# EAGLE design 20A-20 (EAGLE 6.3)

## Sheet 1 of 11
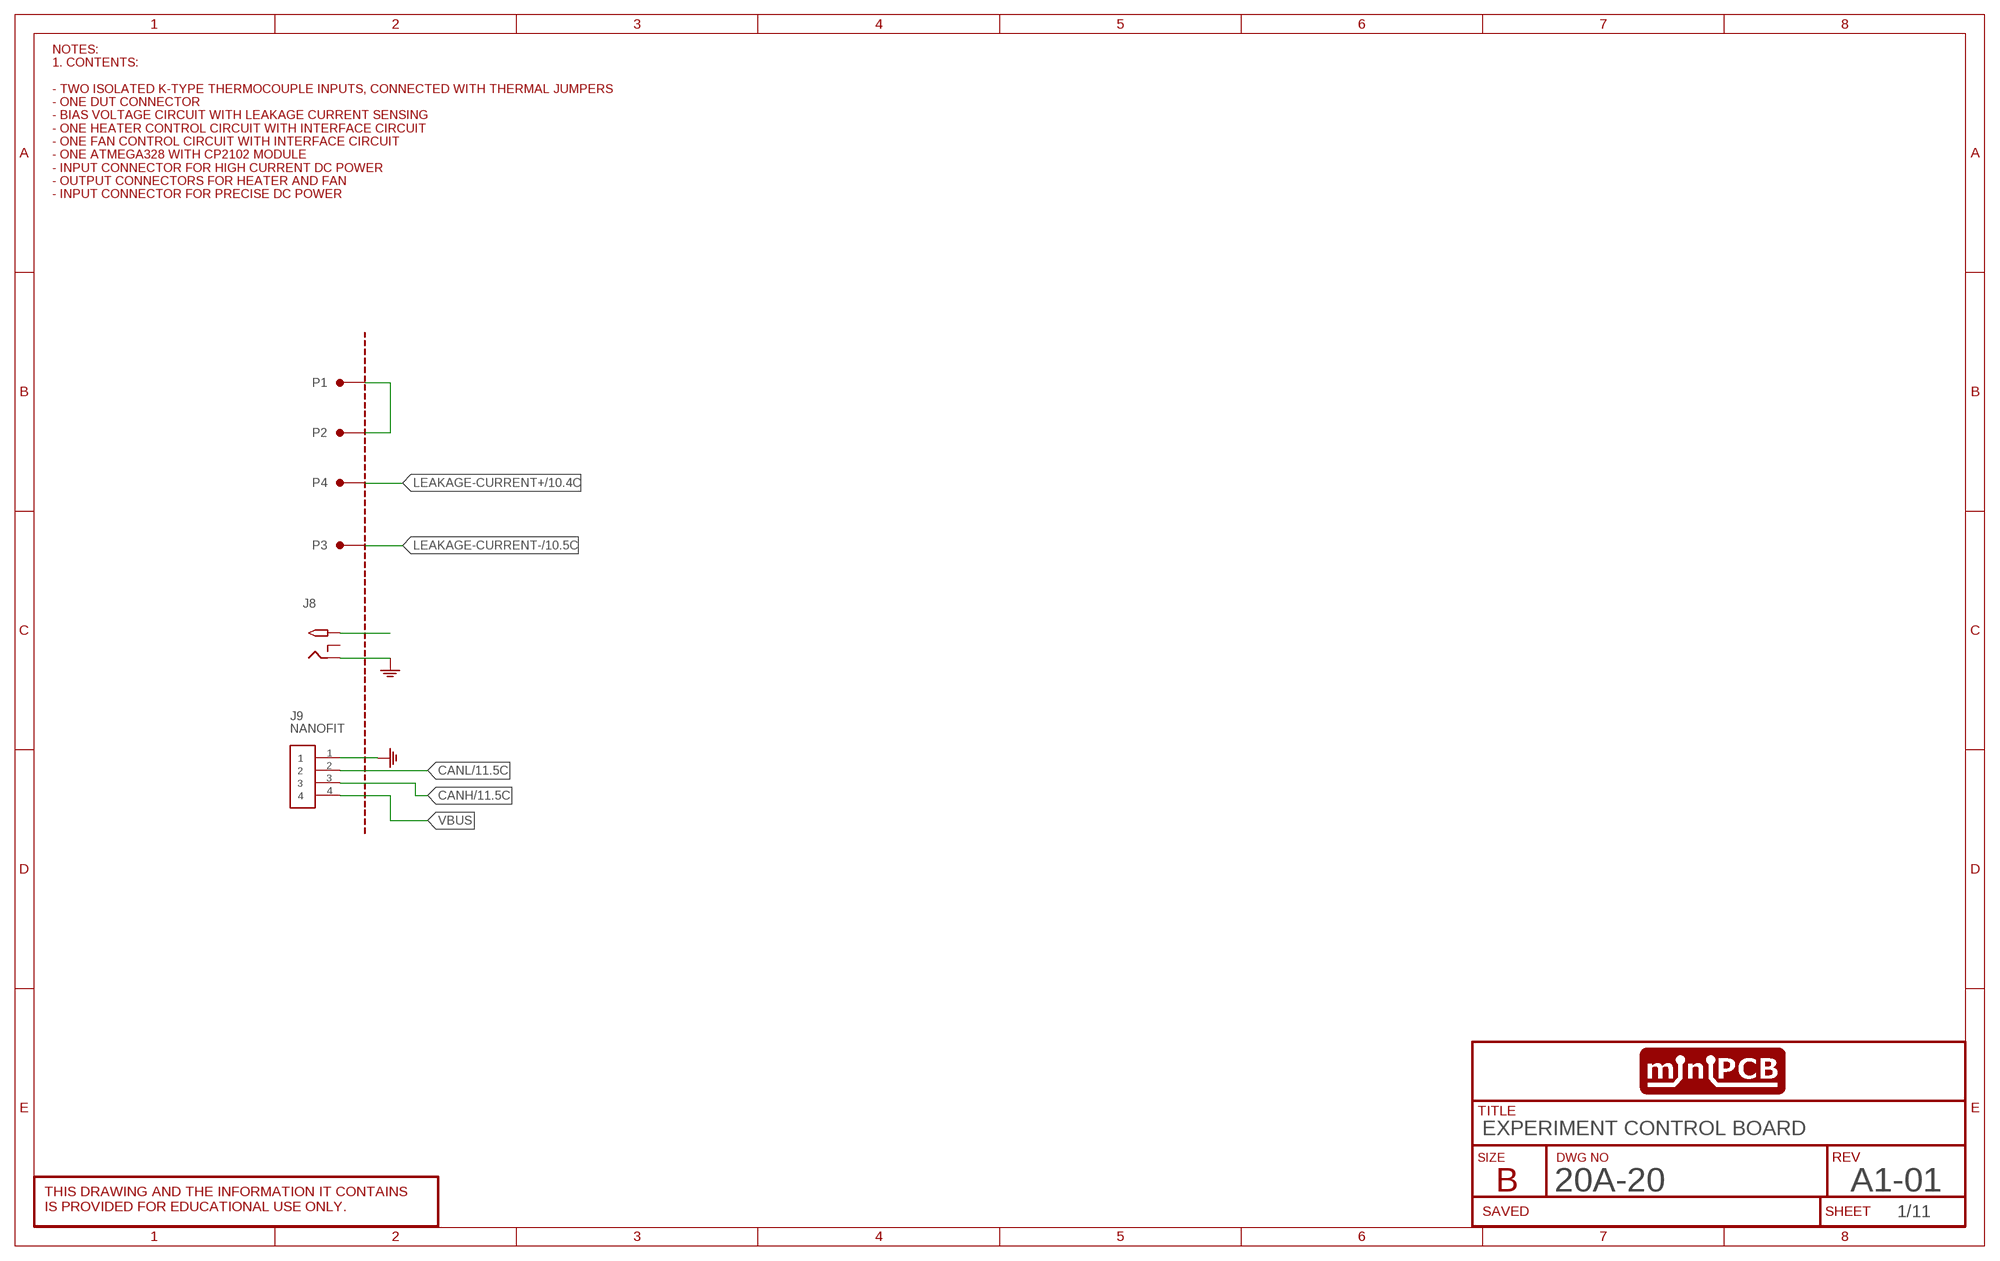
[diagram p0: schematic, sheet 1]
SHEET1 (SCHEMATIC): DWG_NO: 20A-20; REV: A1-01; TITLE: EXPERIMENT CONTROL BOARD

### Parts
J8  2.1MMJACKTHM  [PJ-102A]
J9  NANOFIT  PINS_4-NANOFIT  [PINS_4_NANOFIT_RA]
P1  PINS_1571-0500  [BANNAN_JACK_4MM_H]
P2  PINS_1571-0500  [BANNAN_JACK_4MM_H]
P3  PINS_1571-0500  [BANNAN_JACK_4MM_H]
P4  PINS_1571-0500  [BANNAN_JACK_4MM_H]
PCB1  MINIPCB_0P100X100  [MINIPCB_DOCK_100X100]

### Nets
CANH: J9.3 ; also sheet 11
CANL: J9.2 ; also sheet 11
GND: J8.RING J9.1 ; also sheet 2,3,4,5,6,7,8,10,11
LEAKAGE-CURRENT+: P4.1 P4.2 ; also sheet 10
LEAKAGE-CURRENT-: P3.1 P3.2 ; also sheet 10
N$50: J8.TIP
N$51: P1.1 P1.2 P2.1 P2.2
VBUS: J9.4
Unconnected: J8.RING_SW

### Notes on the sheet
- NOTES:
  1. CONTENTS:
  
  - TWO ISOLATED K-TYPE THERMOCOUPLE INPUTS, CONNECTED WITH THERMAL JUMPERS
  - ONE DUT CONNECTOR
  - BIAS VOLTAGE CIRCUIT WITH LEAKAGE CURRENT SENSING
  - ONE HEATER CONTROL CIRCUIT WITH INTERFACE CIRCUIT
  - ONE FAN CONTROL CIRCUIT WITH INTERFACE CIRCUIT
  - ONE ATMEGA328 WITH CP2102 MODULE
  - INPUT CONNECTOR FOR HIGH CURRENT DC POWER
  - OUTPUT CONNECTORS FOR HEATER AND FAN
  - INPUT CONNECTOR FOR PRECISE DC POWER

## Sheet 2 of 11
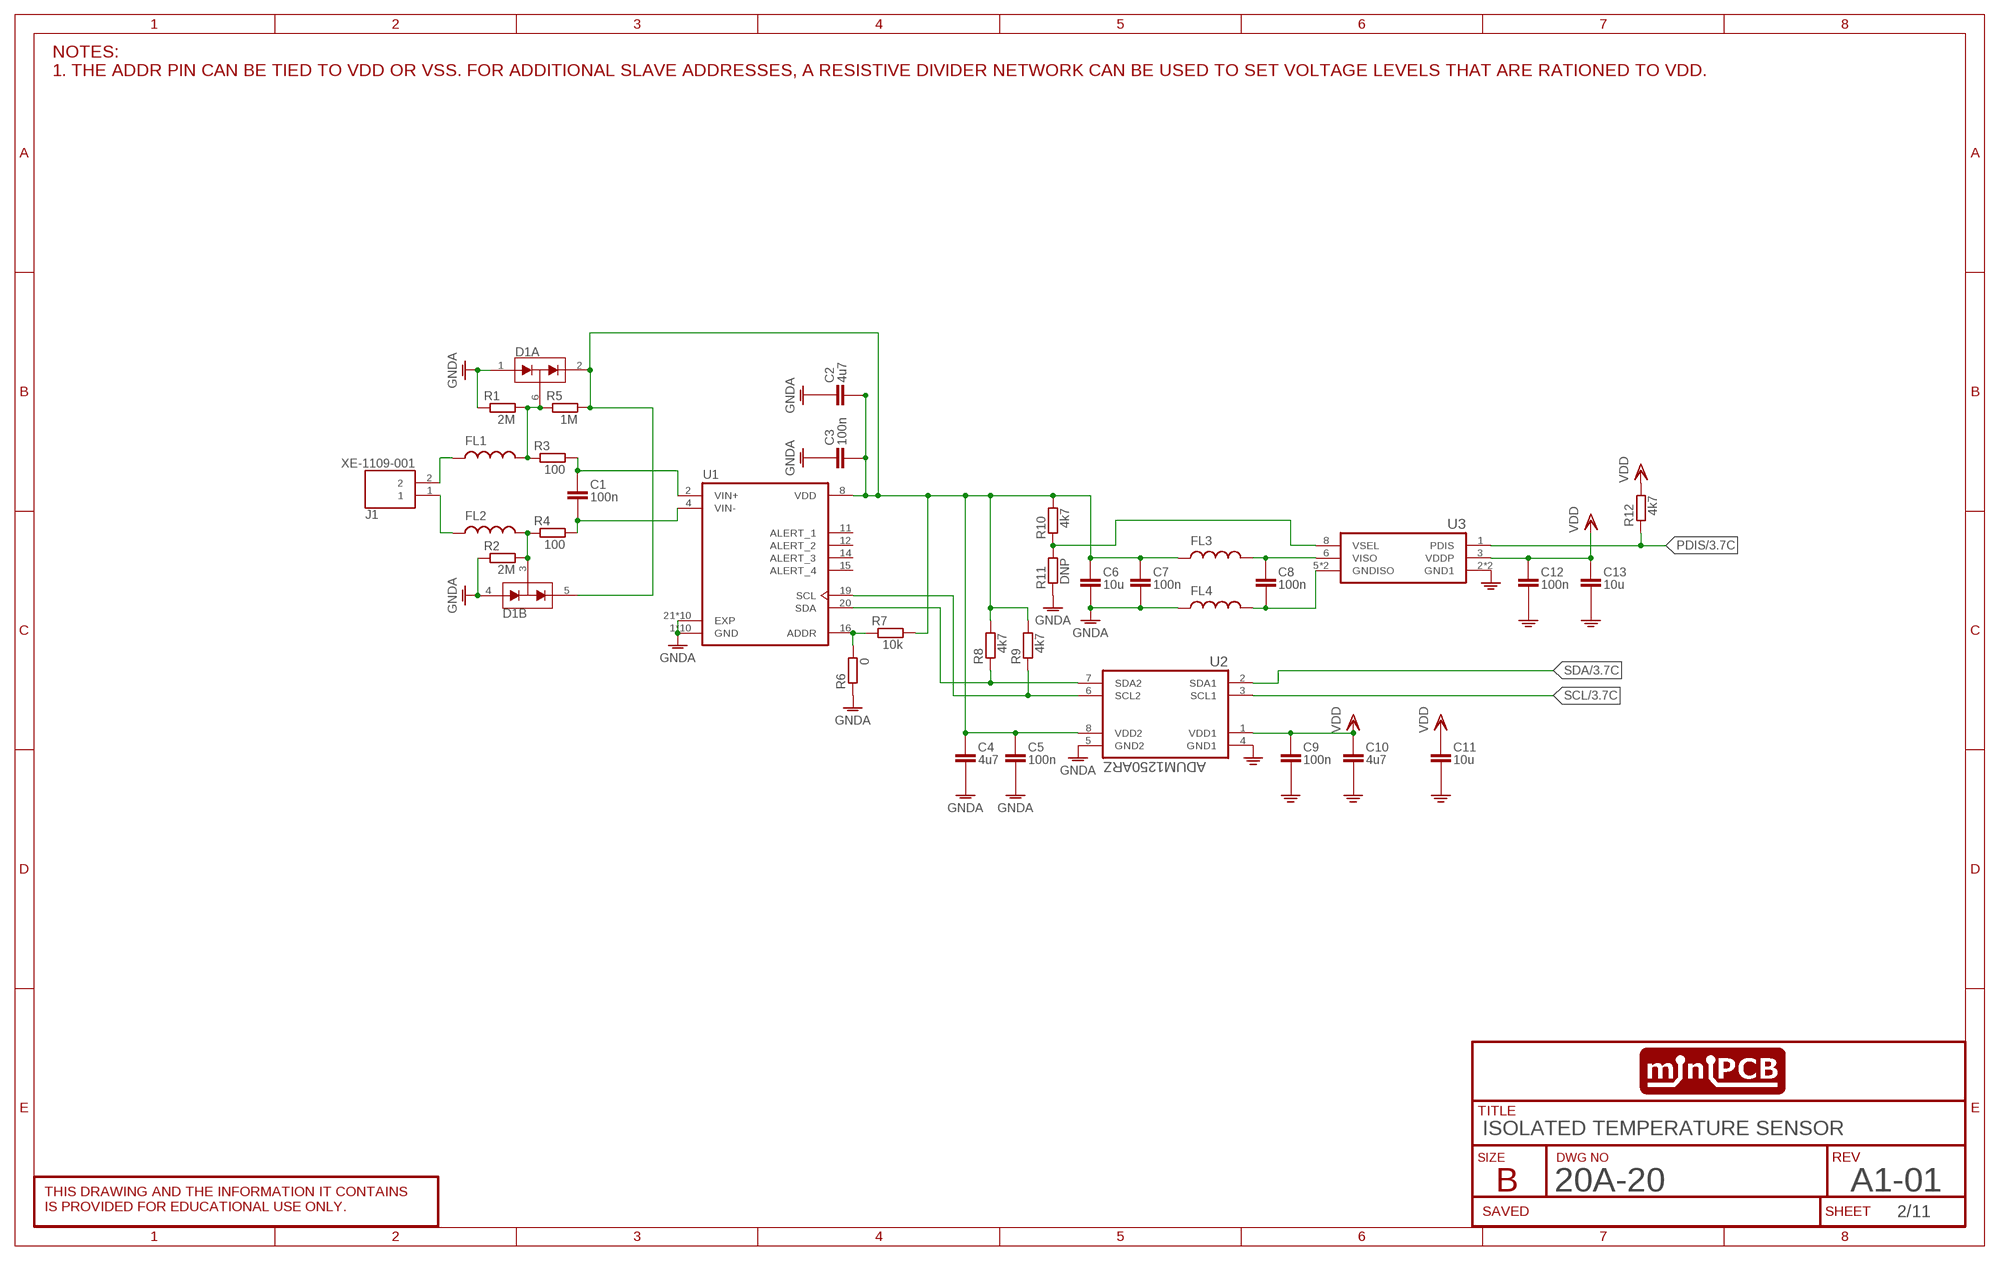
[diagram p1: schematic, sheet 2]
SHEET2 (SCHEMATIC): DWG_NO: 16A-01; REV: A1-01; TITLE: ISOLATED TEMPERATURE SENSOR

### Parts
C1  100n  CAPACITOR0402  [C0402]
C2  4u7  CAPACITOR0402  [C0402]
C3  100n  CAPACITOR0402  [C0402]
C4  4u7  CAPACITOR0402  [C0402]
C5  100n  CAPACITOR0402  [C0402]
C6  10u  CAPACITORSMD  [C0805]
C7  100n  CAPACITOR0402  [C0402]
C8  100n  CAPACITOR0402  [C0402]
C9  100n  CAPACITOR0402  [C0402]
C10  4u7  CAPACITOR0402  [C0402]
C11  10u  CAPACITORSMD  [C0805]
C12  100n  CAPACITOR0402  [C0402]
C13  10u  CAPACITORSMD  [C0805]
D1  SDA004-7  [SOT363]
FL1  BLM03HG601SZ1D  [R0402]
FL2  BLM03HG601SZ1D  [R0402]
FL3  BLM03HG601SZ1D  [R0402]
FL4  BLM03HG601SZ1D  [R0402]
J1  XE-1109-001  [XE-1109-001]
R1  2M  RESISTOR0402  [R0402]
R2  2M  RESISTOR0402  [R0402]
R3  100  RESISTOR0402  [R0402]
R4  100  RESISTOR0402  [R0402]
R5  1M  RESISTOR0402  [R0402]
R6  0  RESISTOR0402  [R0402]
R7  10k  RESISTOR0402  [R0402]
R8  4k7  RESISTOR0402  [R0402]
R9  4k7  RESISTOR0402  [R0402]
R10  4k7  RESISTOR0402  [R0402]
R11  DNP  RESISTOR0402  [R0402]
R12  4k7  RESISTOR0402  [R0402]
U1  MCP9600T-I/MX  [QFN65P500X500X100-21N_MCP9600T-I/MX]
U2  ADUM1250ARZ  [SOIC127P600X175-8N]
U3  ADUM6280  [SOIC127P600X175-8N]

### Nets
GND: C9.2(-) C10.2(-) C11.2ASDF(-) C12.2(-) C13.2ASDF(-) U2.4(GND1) U3.2(GND1) U3.4(GND1) ; also sheet 1,3,4,5,6,7,8,10,11
GNDA: C2.1(+) C3.1(+) C4.2(-) C5.2(-) C6.2ASDF(-) C7.2(-) D1.1(A:A1) D1.4(B:A1) FL4.1 R1.1 R2.1 R6.1 R11.1 U1.1(GND) U1.3(GND) U1.5(GND) U1.6(GND) U1.7(GND) U1.9(GND) U1.10(GND) U1.13(GND) U1.17(GND) U1.18(GND) U1.21(EXP) U1.22(EXP) U1.23(EXP) U1.24(EXP) U1.25(EXP) U1.26(EXP) U1.27(EXP) U1.28(EXP) U1.29(EXP) U1.30(EXP) U2.5(GND2) ; also sheet 3
N$1: D1.6(A:COM) FL1.2 R1.2 R3.1 R5.1
N$2: R9.1 U1.19(SCL) U2.6(SCL2)
N$3: R8.1 U1.20(SDA) U2.7(SDA2)
N$5: C8.2(-) FL4.2 U3.5(GNDISO) U3.7(GNDISO)
N$6: C8.1(+) FL3.2 U3.6(VISO)
N$7: R10.1 R11.2 U3.8(VSEL)
N$9: R6.2 R7.1 U1.16(ADDR)
N$10: C1.1(+) R3.2 U1.2(VIN+)
N$11: D1.3(B:COM) FL2.2 R2.2 R4.1
N$12: C1.2(-) R4.2 U1.4(VIN-)
N$13: FL1.1 J1.2
N$14: FL2.1 J1.1
PDIS: R12.1 U3.1(PDIS) ; also sheet 3,8
SCL: U2.3(SCL1) ; also sheet 3,4,8,10
SDA: U2.2(SDA1) ; also sheet 3,4,8,10
VDD: C9.1(+) C10.1(+) C11.1ASD(+) C12.1(+) C13.1ASD(+) R12.2 U2.1(VDD1) U3.3(VDDP) ; also sheet 3,4,5,6,7,8,10,11
VISO: C2.2(-) C3.2(-) C4.1(+) C5.1(+) C6.1ASD(+) C7.1(+) D1.2(A:C2) D1.5(B:C2) FL3.1 R5.2 R7.2 R8.2 R9.2 R10.2 U1.8(VDD) U2.8(VDD2)
Unconnected: U1.11(ALERT_1) U1.12(ALERT_2) U1.14(ALERT_3) U1.15(ALERT_4)

### Notes on the sheet
- NOTES:
  1. THE ADDR PIN CAN BE TIED TO VDD OR VSS. FOR ADDITIONAL SLAVE ADDRESSES, A RESISTIVE DIVIDER NETWORK CAN BE USED TO SET VOLTAGE LEVELS THAT ARE RATIONED TO VDD.

## Sheet 3 of 11
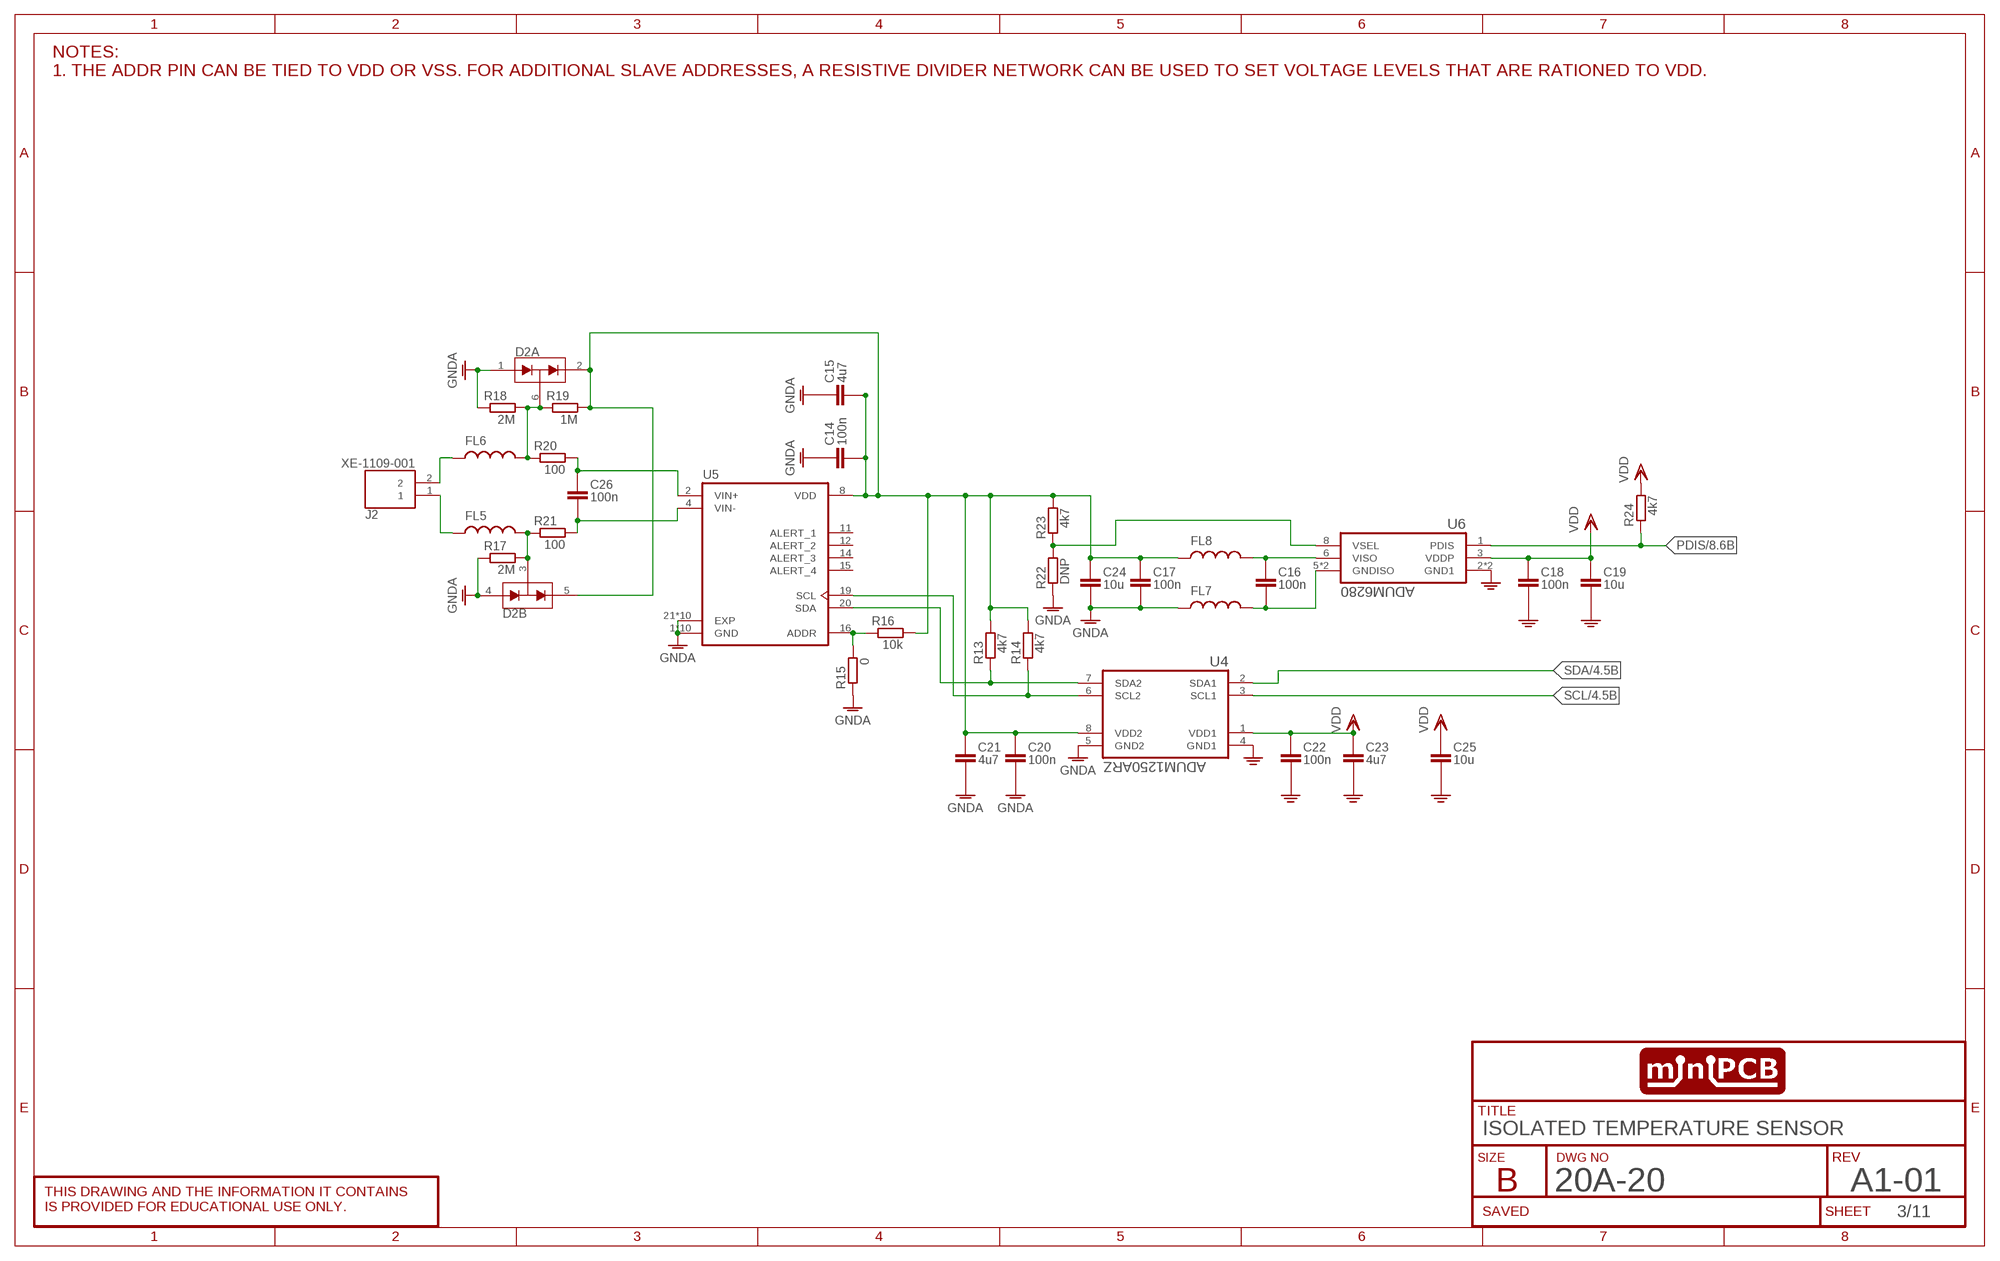
[diagram p2: schematic, sheet 3]
SHEET3 (SCHEMATIC): DWG_NO: 16A-01; REV: A1-01; TITLE: ISOLATED TEMPERATURE SENSOR

### Parts
C14  100n  CAPACITOR0402  [C0402]
C15  4u7  CAPACITOR0402  [C0402]
C16  100n  CAPACITOR0402  [C0402]
C17  100n  CAPACITOR0402  [C0402]
C18  100n  CAPACITOR0402  [C0402]
C19  10u  CAPACITORSMD  [C0805]
C20  100n  CAPACITOR0402  [C0402]
C21  4u7  CAPACITOR0402  [C0402]
C22  100n  CAPACITOR0402  [C0402]
C23  4u7  CAPACITOR0402  [C0402]
C24  10u  CAPACITORSMD  [C0805]
C25  10u  CAPACITORSMD  [C0805]
C26  100n  CAPACITOR0402  [C0402]
D2  SDA004-7  [SOT363]
FL5  BLM03HG601SZ1D  [R0402]
FL6  BLM03HG601SZ1D  [R0402]
FL7  BLM03HG601SZ1D  [R0402]
FL8  BLM03HG601SZ1D  [R0402]
J2  XE-1109-001  [XE-1109-001]
R13  4k7  RESISTOR0402  [R0402]
R14  4k7  RESISTOR0402  [R0402]
R15  0  RESISTOR0402  [R0402]
R16  10k  RESISTOR0402  [R0402]
R17  2M  RESISTOR0402  [R0402]
R18  2M  RESISTOR0402  [R0402]
R19  1M  RESISTOR0402  [R0402]
R20  100  RESISTOR0402  [R0402]
R21  100  RESISTOR0402  [R0402]
R22  DNP  RESISTOR0402  [R0402]
R23  4k7  RESISTOR0402  [R0402]
R24  4k7  RESISTOR0402  [R0402]
U4  ADUM1250ARZ  [SOIC127P600X175-8N]
U5  MCP9600T-I/MX  [QFN65P500X500X100-21N_MCP9600T-I/MX]
U6  ADUM6280  [SOIC127P600X175-8N]

### Nets
GND: C18.2(-) C19.2ASDF(-) C22.2(-) C23.2(-) C25.2ASDF(-) U4.4(GND1) U6.2(GND1) U6.4(GND1) ; also sheet 1,2,4,5,6,7,8,10,11
GNDA: C14.1(+) C15.1(+) C17.2(-) C20.2(-) C21.2(-) C24.2ASDF(-) D2.1(A:A1) D2.4(B:A1) FL7.1 R15.1 R17.1 R18.1 R22.1 U4.5(GND2) U5.1(GND) U5.3(GND) U5.5(GND) U5.6(GND) U5.7(GND) U5.9(GND) U5.10(GND) U5.13(GND) U5.17(GND) U5.18(GND) U5.21(EXP) U5.22(EXP) U5.23(EXP) U5.24(EXP) U5.25(EXP) U5.26(EXP) U5.27(EXP) U5.28(EXP) U5.29(EXP) U5.30(EXP) ; also sheet 2
N$4: R14.1 U4.6(SCL2) U5.19(SCL)
N$8: R13.1 U4.7(SDA2) U5.20(SDA)
N$15: R15.2 R16.1 U5.16(ADDR)
N$16: D2.6(A:COM) FL6.2 R18.2 R19.1 R20.1
N$17: D2.3(B:COM) FL5.2 R17.2 R21.1
N$18: C26.1(+) R20.2 U5.2(VIN+)
N$19: C26.2(-) R21.2 U5.4(VIN-)
N$20: FL6.1 J2.2
N$21: FL5.1 J2.1
N$22: R22.2 R23.1 U6.8(VSEL)
N$23: C16.2(-) FL7.2 U6.5(GNDISO) U6.7(GNDISO)
N$24: C16.1(+) FL8.2 U6.6(VISO)
PDIS: R24.1 U6.1(PDIS) ; also sheet 2,8
SCL: U4.3(SCL1) ; also sheet 2,4,8,10
SDA: U4.2(SDA1) ; also sheet 2,4,8,10
VDD: C18.1(+) C19.1ASD(+) C22.1(+) C23.1(+) C25.1ASD(+) R24.2 U4.1(VDD1) U6.3(VDDP) ; also sheet 2,4,5,6,7,8,10,11
VISO1: C14.2(-) C15.2(-) C17.1(+) C20.1(+) C21.1(+) C24.1ASD(+) D2.2(A:C2) D2.5(B:C2) FL8.1 R13.2 R14.2 R16.2 R19.2 R23.2 U4.8(VDD2) U5.8(VDD)
Unconnected: U5.11(ALERT_1) U5.12(ALERT_2) U5.14(ALERT_3) U5.15(ALERT_4)

### Notes on the sheet
- NOTES:
  1. THE ADDR PIN CAN BE TIED TO VDD OR VSS. FOR ADDITIONAL SLAVE ADDRESSES, A RESISTIVE DIVIDER NETWORK CAN BE USED TO SET VOLTAGE LEVELS THAT ARE RATIONED TO VDD.

## Sheet 4 of 11
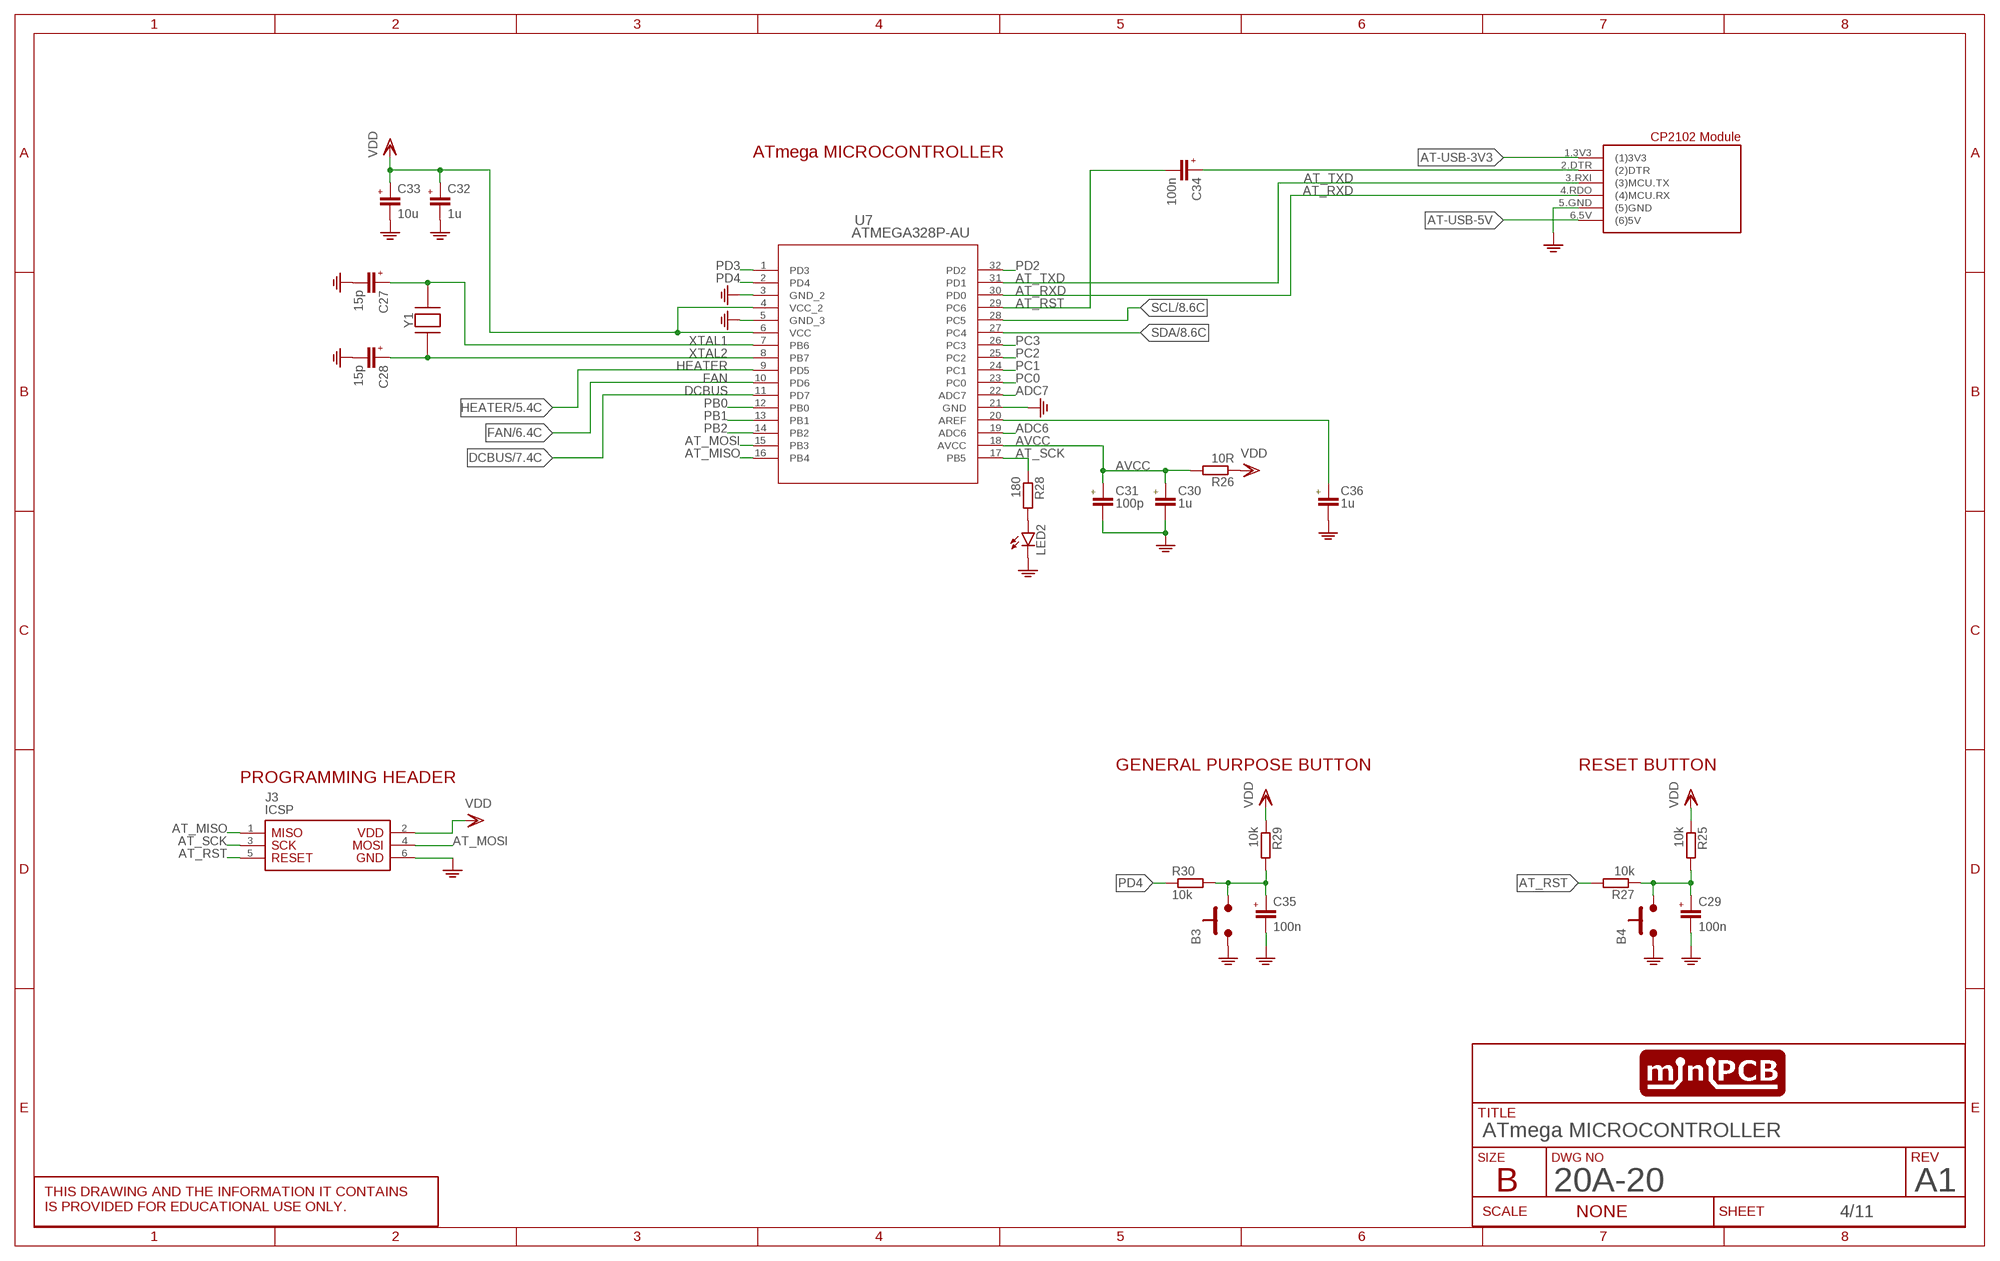
[diagram p3: schematic, sheet 4]
SHEET4 (SCHEMATIC): CIRCUIT_CATEGORY: COMPUTING; CIRCUIT_NAME: MICROCONTROLLER BOARD; CIRCUIT_VARIANT: PIC16F1829, ATmega328P-AU; DR: N. MANTEUFEL; DR_DATE: 31JUL2023; ENG: P. MORTON; ENG_DATE: 31JUL2023; PCB_PCBA: PRINTED CIRCUIT BOARD; REVA: A; REVISION: A1; TITLE: ATmega MICROCONTROLLER

### Parts
B3  PUSHBUTTON6X6MM  [6X6MM]
B4  PUSHBUTTON6X6MM  [6X6MM]
C27  15p  C0603  [C0603]
C28  15p  C0603  [C0603]
C29  100n  C0805  [C0805]
C30  1u  C-EU_C0805  [C0805]
C31  100p  C-EU_C0805  [C0805]
C32  1u  C0805  [C0805]
C33  10u  C0805  [C0805]
C34  100n  C0805  [C0805]
C35  100n  C0805  [C0805]
C36  1u  C-EU_C0805  [C0805]
J3  ICSP  PINS_6-2X3_AT  [PINS_6-2X3_AT]
LED2  LEDSML0805  [SML0805]
R25  10k  R-EU__R0805  [R0805]
R26  10R  R-EU__R0805  [R0805]
R27  10k  R-EU__R0805  [R0805]
R28  180  R-EU__R0805  [R0805]
R29  10k  R-EU__R0805  [R0805]
R30  10k  R-EU__R0805  [R0805]
U7  ATMEGA328P-AU  ATMEGA328-AU  [32A_ATM]
U8  VIVA_USB-TTL  [VIVA_USB_TTL_SUBTEXT]
Y1  CRYSTAL-3225_4P  [TXC7M2]

### Nets
ADC6: U7.19(ADC6)
ADC7: U7.22(ADC7)
AT-USB-3V3: U8.1.3V3((1)3V3)
AT-USB-5V: U8.6.5V((6)5V)
AT_DTR_CAP: C34.1(+) U8.2.DTR((2)DTR)
AT_MISO: J3.1 U7.16(PB4)
AT_MOSI: J3.4 U7.15(PB3)
AT_RST: C34.2(-) J3.5 R27.2 U7.29(PC6)
AT_RST_CAP: B4.3.B B4.4.B C29.1(+) R25.2 R27.1
AT_RXD: U7.30(PD0) U8.4.RDO((4)MCU.RX)
AT_SCK: J3.3 R28.1 U7.17(PB5)
AT_TXD: U7.31(PD1) U8.3.RXI((3)MCU.TX)
AVCC: C30.1 C31.1 R26.2 U7.18(AVCC)
DCBUS: U7.11(PD7) ; also sheet 7
FAN: U7.10(PD6) ; also sheet 6
GND: B3.1.A B3.2.A B4.1.A B4.2.A C27.1(-) C28.1(-) C29.2(-) C30.2 C31.2 C32.2(-) C33.2(-) C35.2(-) C36.2 J3.6 LED2.C U7.3(GND_2) U7.5(GND_3) U7.21(GND) U8.5.GND((5)GND) ; also sheet 1,2,3,5,6,7,8,10,11
HEATER: U7.9(PD5) ; also sheet 5
N$25: C36.1 U7.20(AREF)
N$37: LED2.A R28.2
PB0: U7.12(PB0)
PB1: U7.13(PB1)
PB2: U7.14(PB2)
PC0: U7.23(PC0)
PC1: U7.24(PC1)
PC2: U7.25(PC2)
PC3: U7.26(PC3)
PD2: U7.32(PD2)
PD3: U7.1(PD3)
PD4: R30.1 U7.2(PD4)
PD4-CAP: B3.3.B B3.4.B C35.1(+) R29.2 R30.2
SCL: U7.28(PC5) ; also sheet 2,3,8,10
SDA: U7.27(PC4) ; also sheet 2,3,8,10
VDD: C32.1(+) C33.1(+) J3.2 R25.1 R26.1 R29.1 U7.4(VCC_2) U7.6(VCC) ; also sheet 2,3,5,6,7,8,10,11
XTAL1: C27.2(+) U7.7(PB6) Y1.3
XTAL2: C28.2(+) U7.8(PB7) Y1.1

### Notes on the sheet
- ATmega MICROCONTROLLER
- GENERAL PURPOSE BUTTON | RESET BUTTON
- PROGRAMMING HEADER

## Sheet 5 of 11
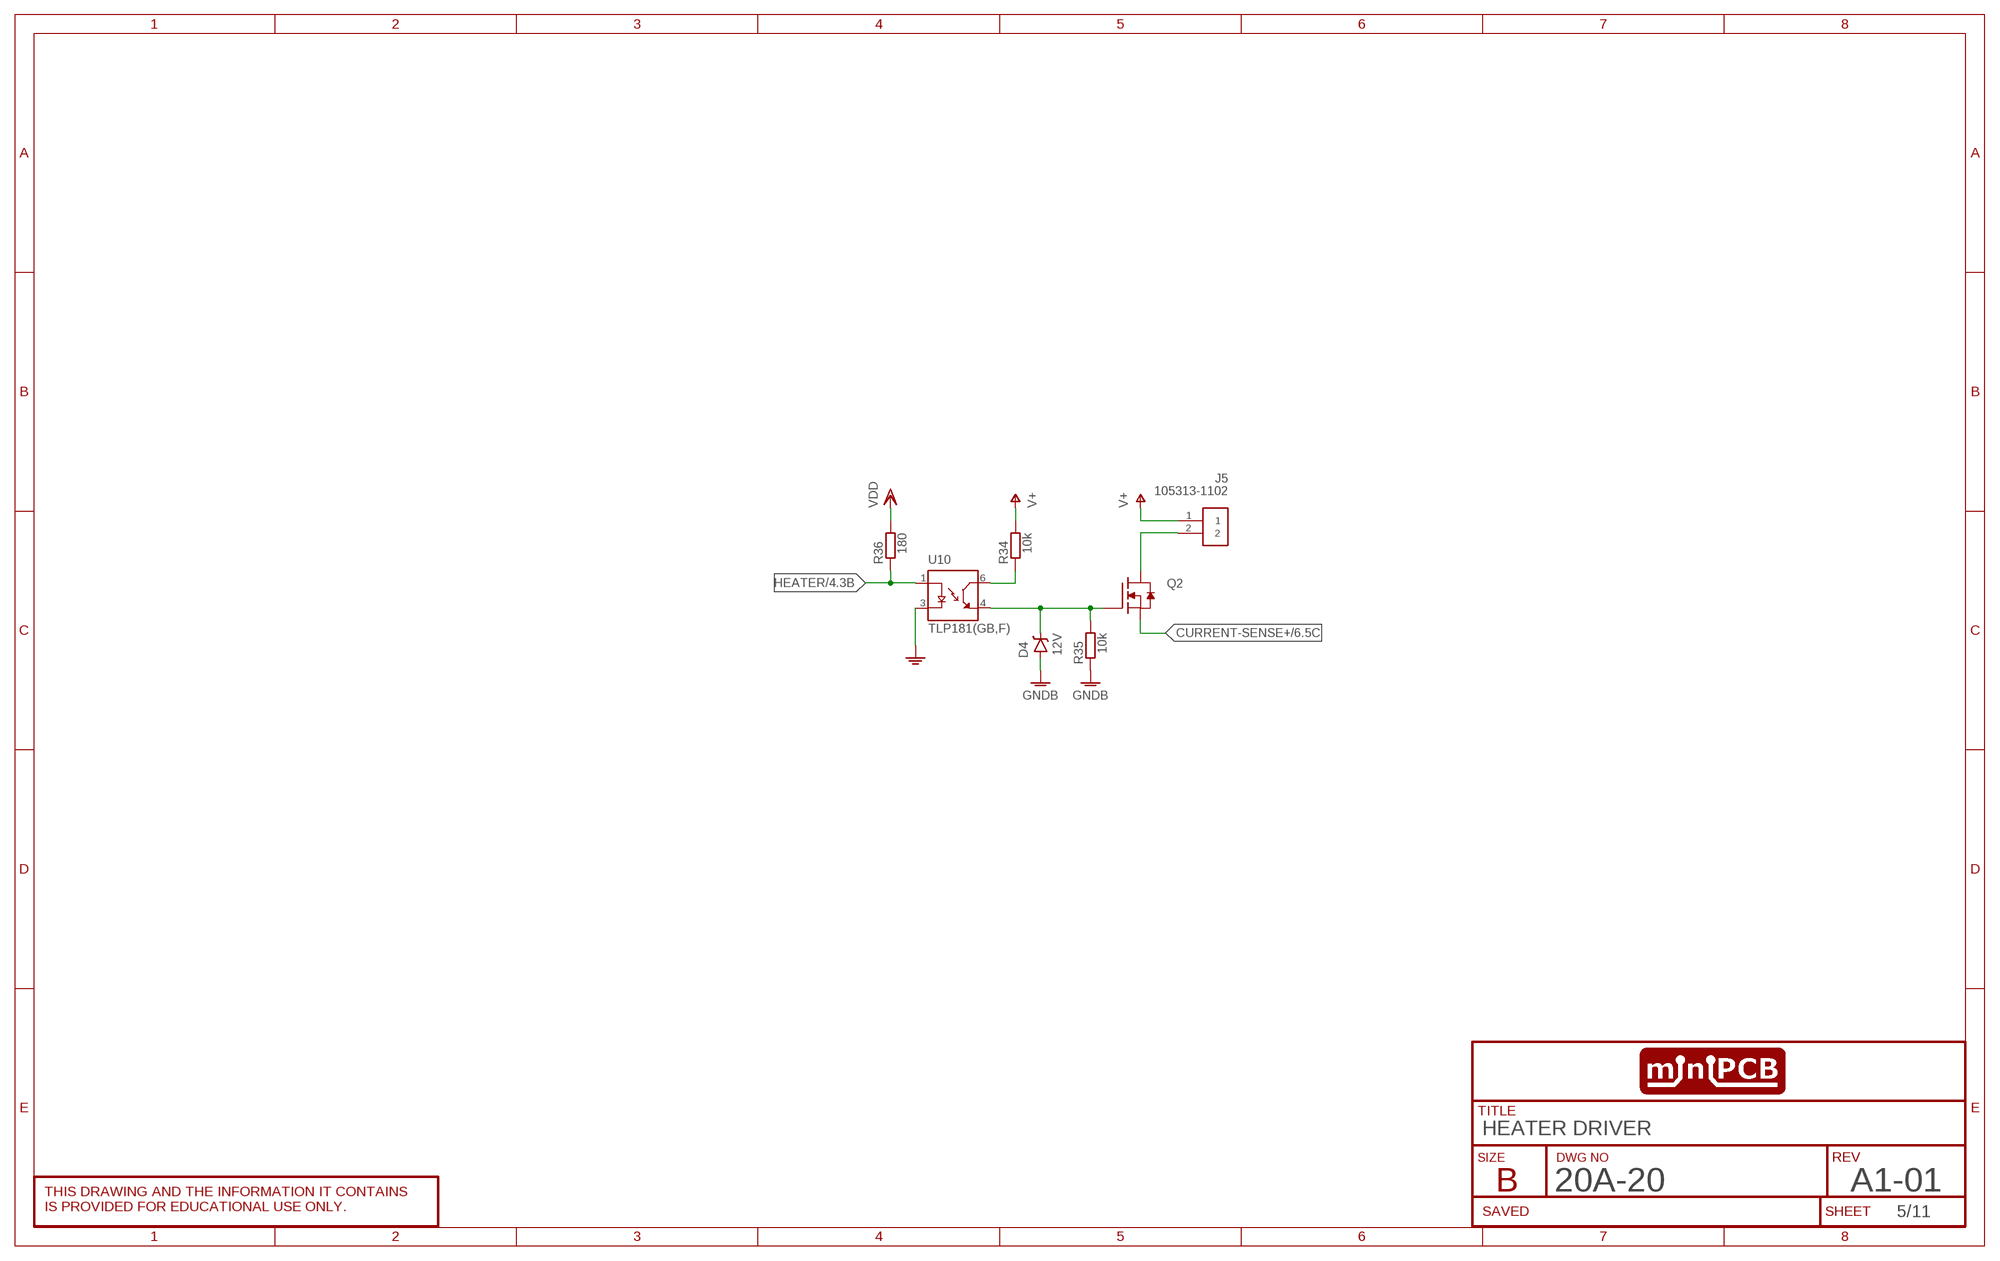
[diagram p4: schematic, sheet 5]
SHEET5 (SCHEMATIC): DWG_NO: 09F-01; REV: A1-01; TITLE: HEATER DRIVER

### Parts
D4  12V  ZENERSOT23  [SOT23]
J5  105313-1102  PINS_2-NANOFIT-105313-1102  [PINS_2-NANOFIT-H]
Q2  MOSFET-NDPAK  [DPACK]
R34  10k  RESISTORSMD  [R0805]
R35  10k  RESISTORSMD  [R0805]
R36  180  RESISTORSMD  [R0805]
U10  TLP181(GB,F)  [SOIC254P700X280-4N]

### Nets
CURRENT-SENSE+: Q2.3(S) ; also sheet 6,9
GND: U10.3(C) ; also sheet 1,2,3,4,6,7,8,10,11
GNDB: D4.1(A) R35.1 ; also sheet 6,7,8,9
HEATER: R36.1 U10.1(A) ; also sheet 4
N$28: D4.3(C) Q2.1(G) R35.2 U10.4(ET)
N$32: J5.2 Q2.4(D)
N$35: R34.1 U10.6(CT)
V+: J5.1 R34.2 ; also sheet 6,7
VDD: R36.2 ; also sheet 2,3,4,6,7,8,10,11

## Sheet 6 of 11
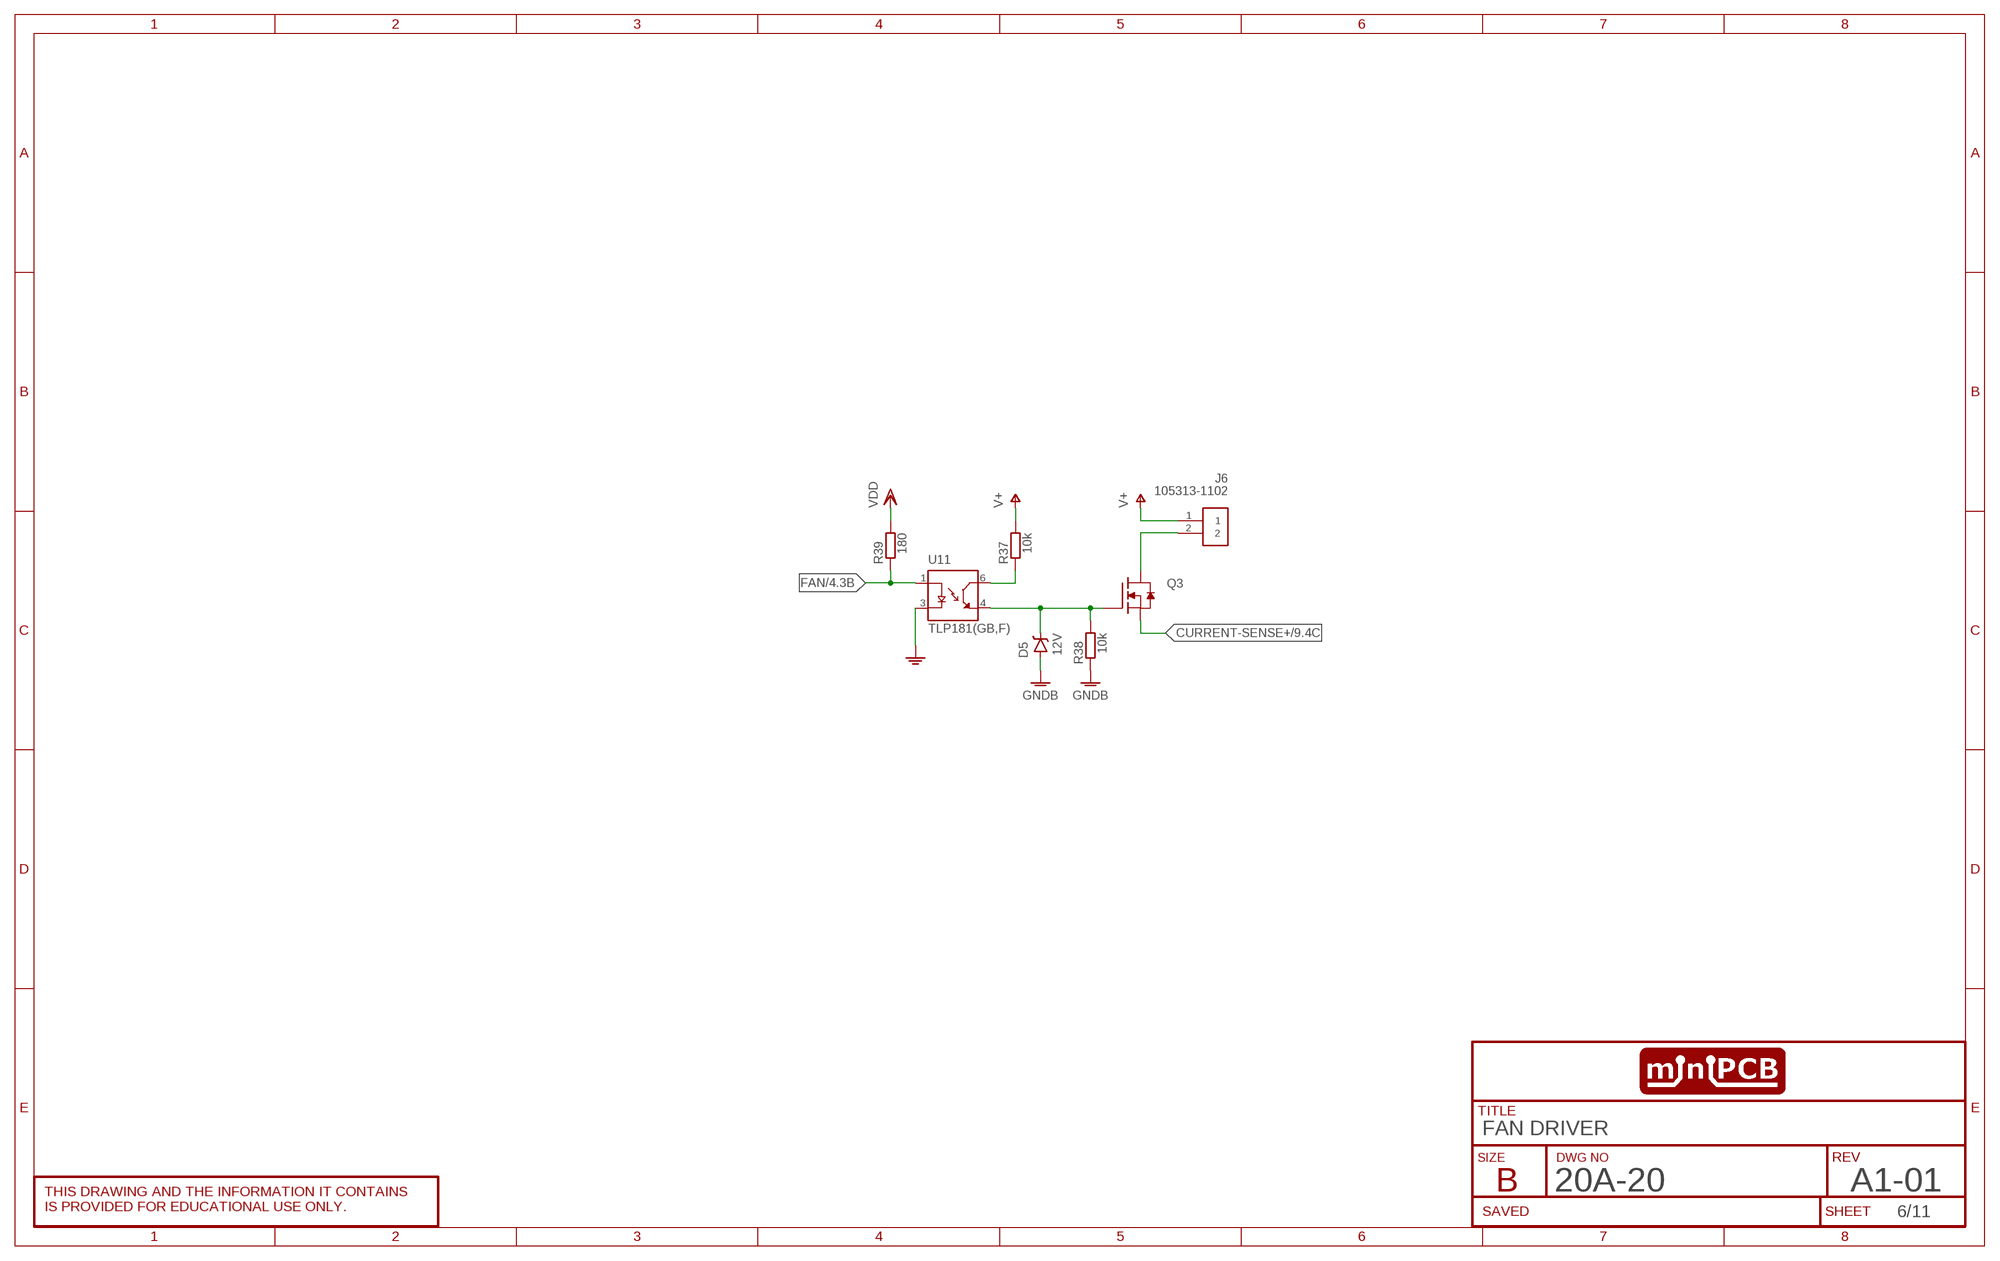
[diagram p5: schematic, sheet 6]
SHEET6 (SCHEMATIC): DWG_NO: 09F-01; REV: A1-01; TITLE: FAN DRIVER

### Parts
D5  12V  ZENERSOT23  [SOT23]
J6  105313-1102  PINS_2-NANOFIT-105313-1102  [PINS_2-NANOFIT-H]
Q3  MOSFET-NDPAK  [DPACK]
R37  10k  RESISTORSMD  [R0805]
R38  10k  RESISTORSMD  [R0805]
R39  180  RESISTORSMD  [R0805]
U11  TLP181(GB,F)  [SOIC254P700X280-4N]

### Nets
CURRENT-SENSE+: Q3.3(S) ; also sheet 5,9
FAN: R39.1 U11.1(A) ; also sheet 4
GND: U11.3(C) ; also sheet 1,2,3,4,5,7,8,10,11
GNDB: D5.1(A) R38.1 ; also sheet 5,7,8,9
N$33: D5.3(C) Q3.1(G) R38.2 U11.4(ET)
N$34: J6.2 Q3.4(D)
N$39: R37.1 U11.6(CT)
V+: J6.1 R37.2 ; also sheet 5,7
VDD: R39.2 ; also sheet 2,3,4,5,7,8,10,11

## Sheet 7 of 11
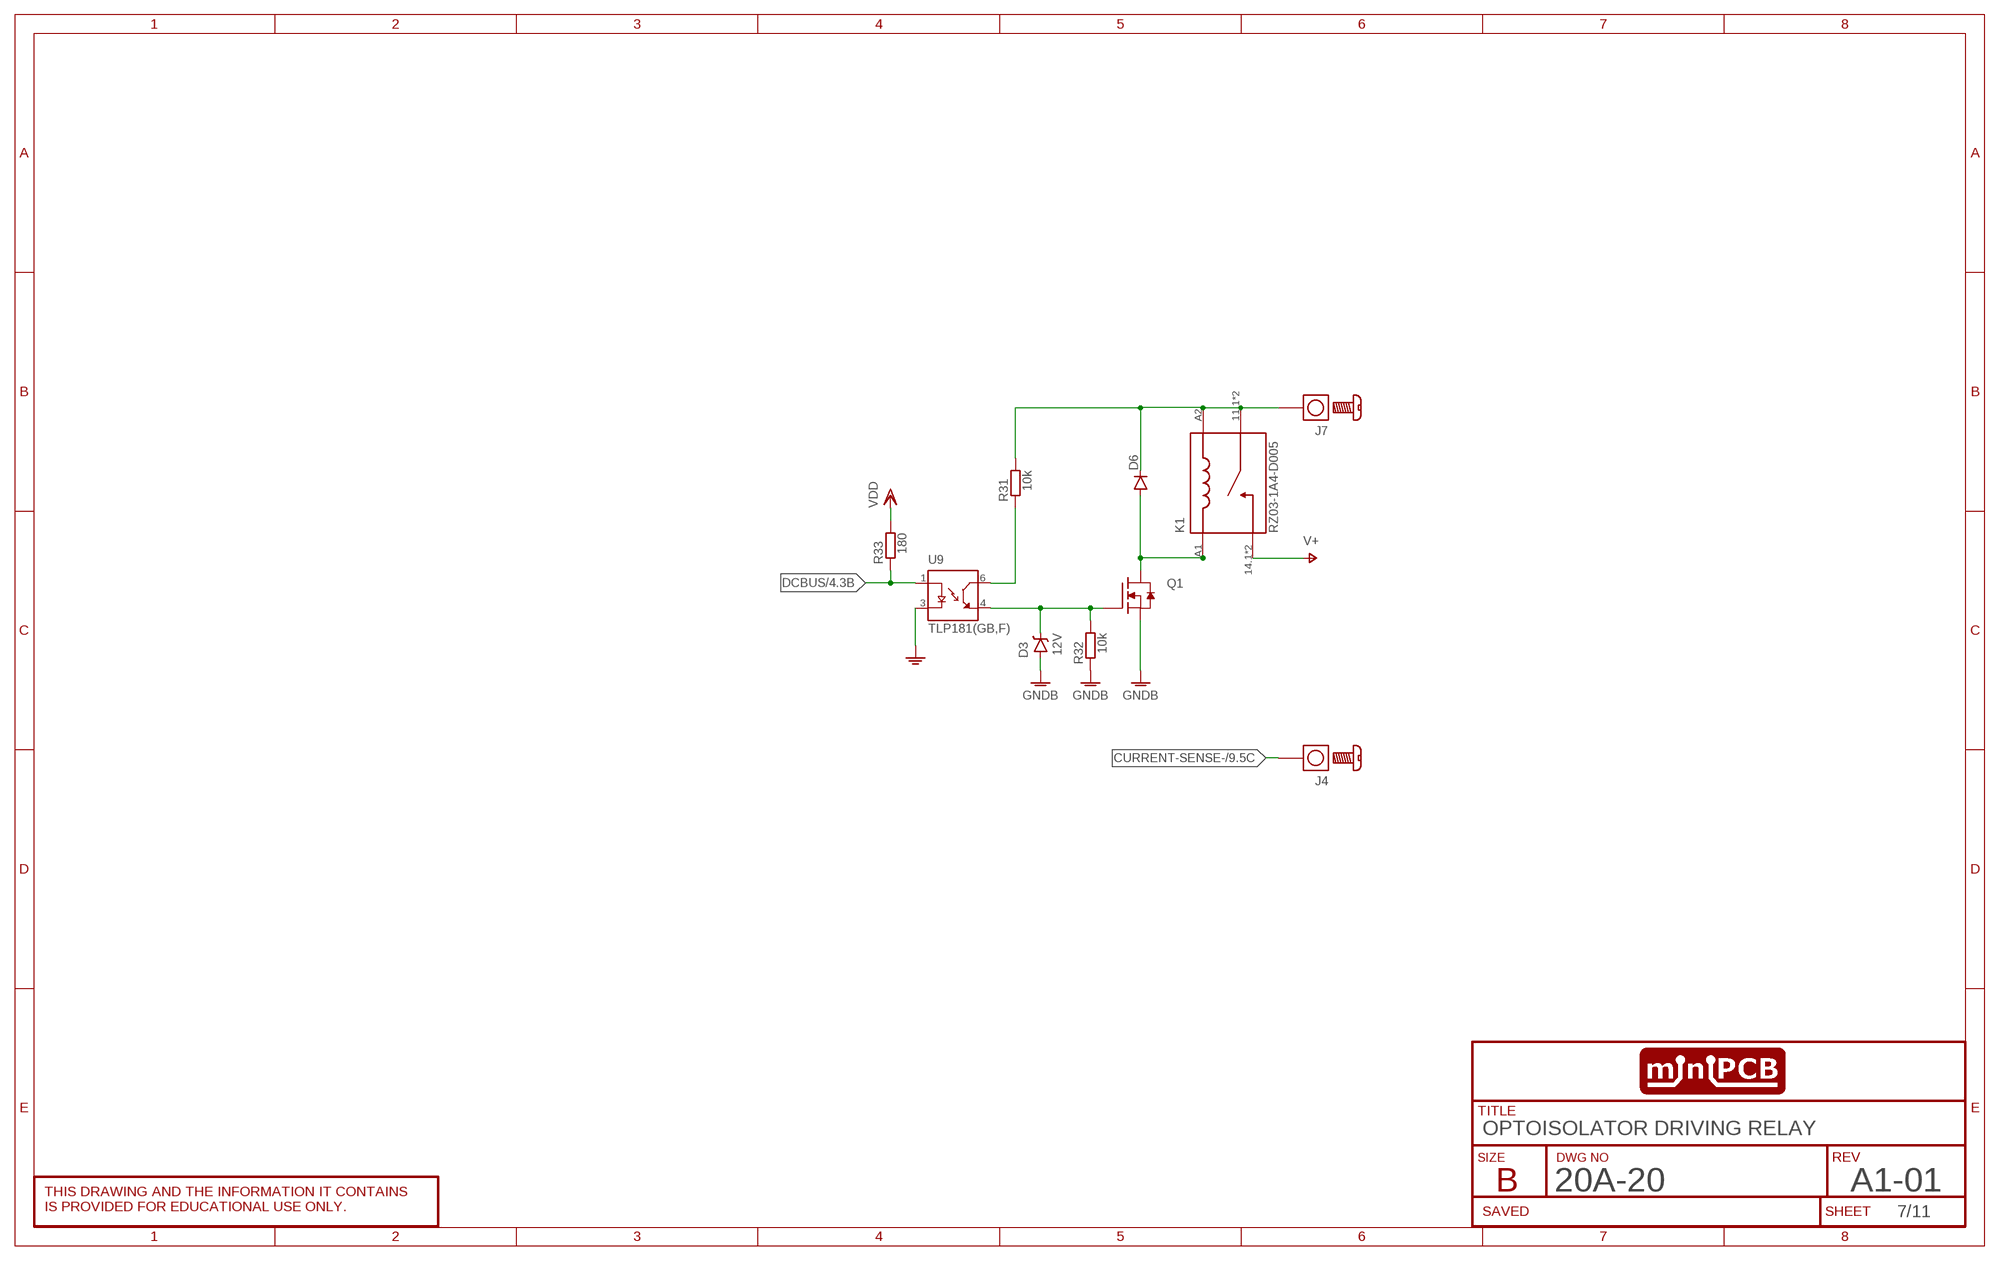
[diagram p6: schematic, sheet 7]
SHEET7 (SCHEMATIC): DWG_NO: 09F-01; REV: A1-01; TITLE: OPTOISOLATOR DRIVING RELAY

### Parts
D3  12V  ZENERSOT23  [SOT23]
D6  DIODE-SOD323-W  [SOD323-W]
J4  SCREW-TERMINAL  [SCREW-TERMINAL-M3]
J7  SCREW-TERMINAL  [SCREW-TERMINAL-M3]
K1  RZ03-1A4-D005  [RELAY_RZ03-1A4-D005]
Q1  MOSFET-NSOT23  [SOT23]
R31  10k  RESISTORSMD  [R0805]
R32  10k  RESISTORSMD  [R0805]
R33  180  RESISTORSMD  [R0805]
U9  TLP181(GB,F)  [SOIC254P700X280-4N]

### Nets
CURRENT-SENSE-: J4.1 J4.2 J4.3 J4.4 ; also sheet 9
DCBUS: R33.1 U9.1(A) ; also sheet 4
GND: U9.3(C) ; also sheet 1,2,3,4,5,6,8,10,11
GNDB: D3.1(A) Q1.2(S) R32.1 ; also sheet 5,6,8,9
N$29: D3.3(C) Q1.1(G) R32.2 U9.4(ET)
N$30: D6.C J7.1 J7.2 J7.3 J7.4 K1.11.1 K1.11.2 K1.A2 R31.2
N$31: D6.A K1.A1 Q1.3(D)
N$36: R31.1 U9.6(CT)
V+: K1.14.1 K1.14.2 ; also sheet 5,6
VDD: R33.2 ; also sheet 2,3,4,5,6,8,10,11

## Sheet 8 of 11
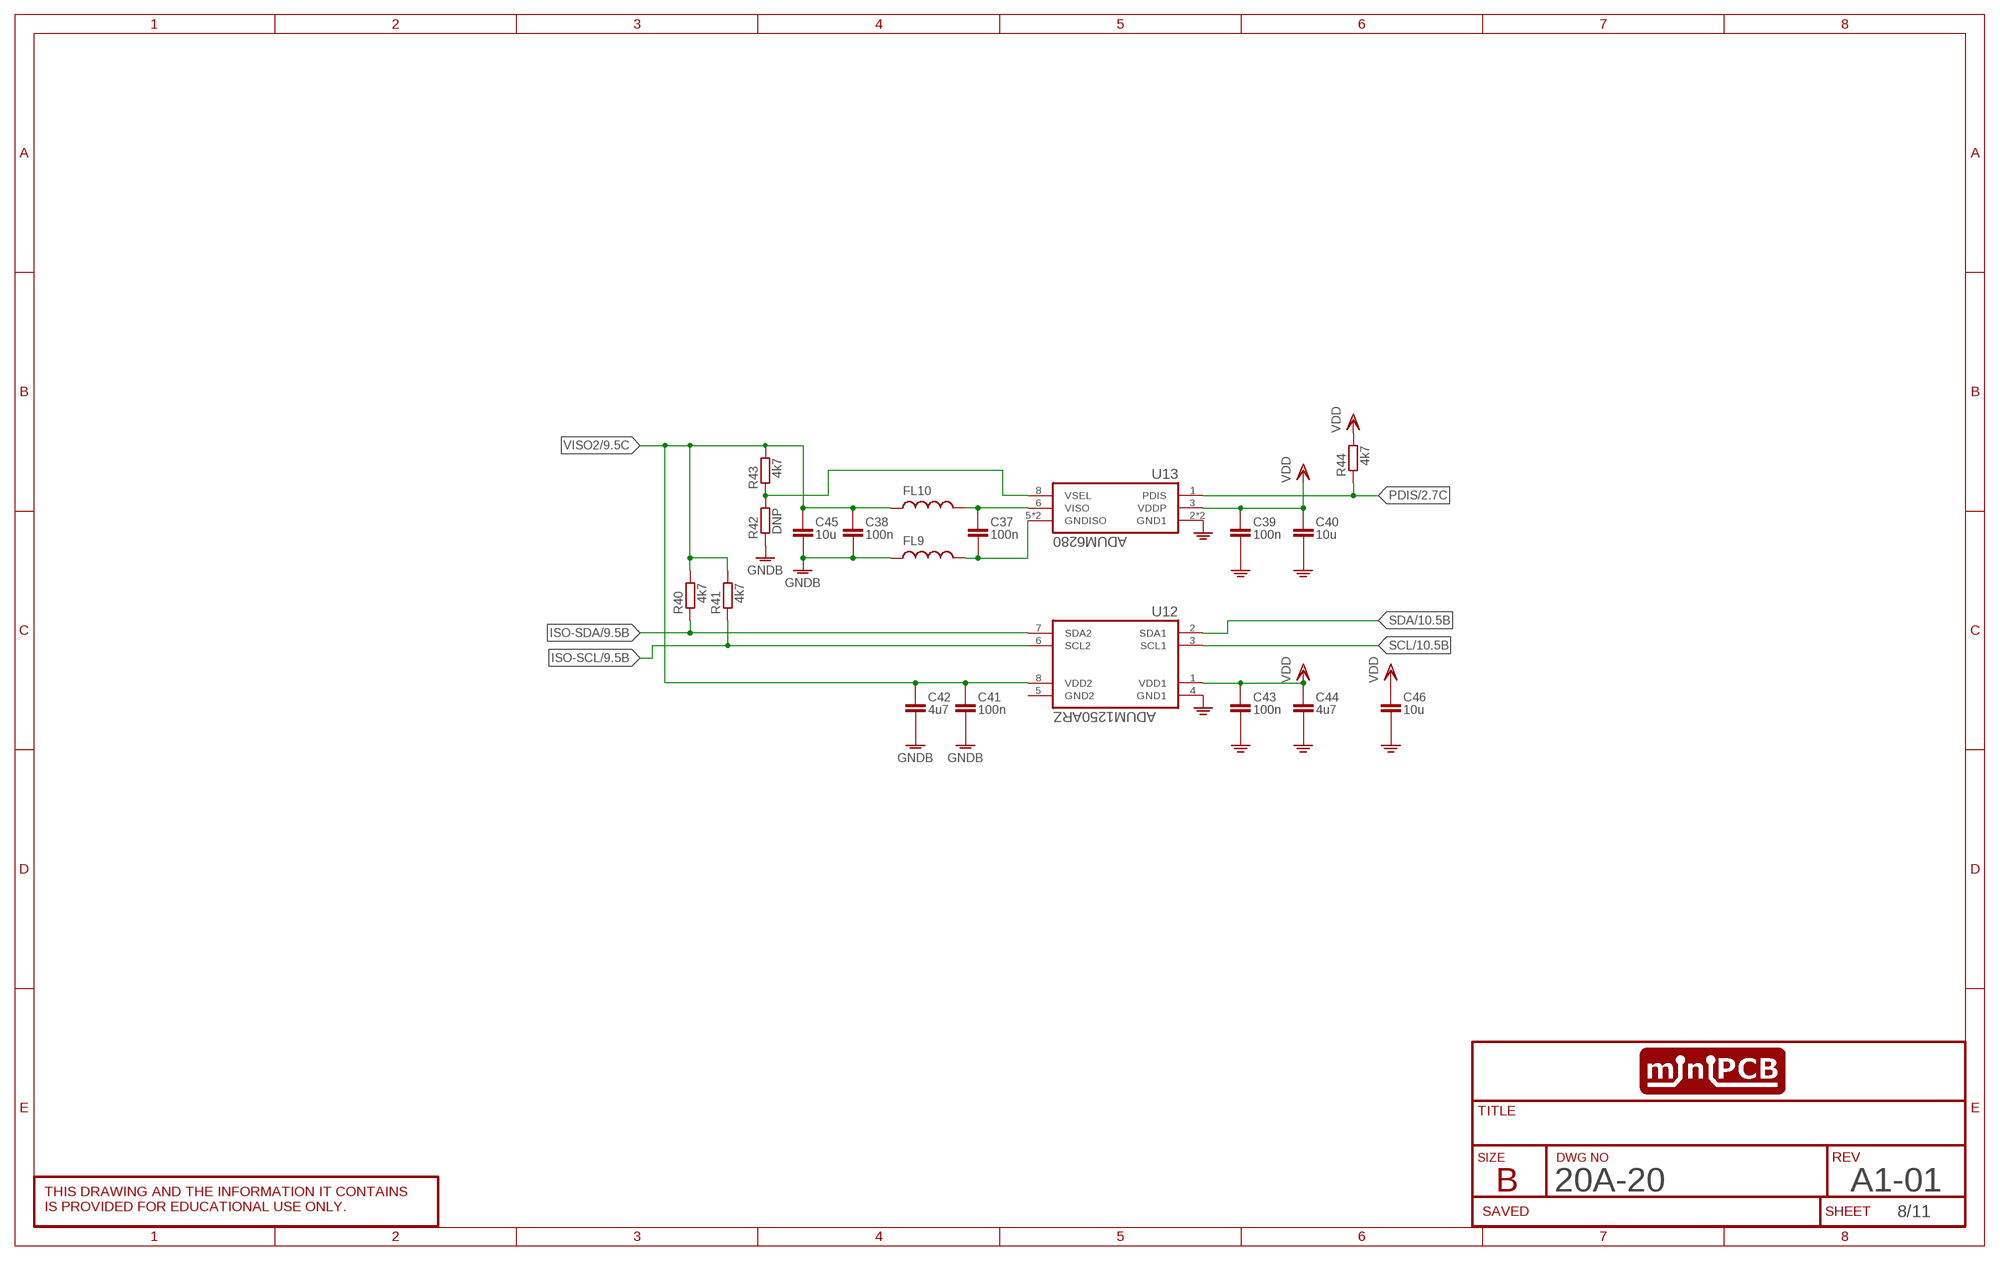
[diagram p7: schematic, sheet 8]
SHEET8 (SCHEMATIC): REV: A1-01

### Parts
C37  100n  CAPACITOR0402  [C0402]
C38  100n  CAPACITOR0402  [C0402]
C39  100n  CAPACITOR0402  [C0402]
C40  10u  CAPACITORSMD  [C0805]
C41  100n  CAPACITOR0402  [C0402]
C42  4u7  CAPACITOR0402  [C0402]
C43  100n  CAPACITOR0402  [C0402]
C44  4u7  CAPACITOR0402  [C0402]
C45  10u  CAPACITORSMD  [C0805]
C46  10u  CAPACITORSMD  [C0805]
FL9  BLM03HG601SZ1D  [R0402]
FL10  BLM03HG601SZ1D  [R0402]
R40  4k7  RESISTOR0402  [R0402]
R41  4k7  RESISTOR0402  [R0402]
R42  DNP  RESISTOR0402  [R0402]
R43  4k7  RESISTOR0402  [R0402]
R44  4k7  RESISTOR0402  [R0402]
U12  ADUM1250ARZ  [SOIC127P600X175-8N]
U13  ADUM6280  [SOIC127P600X175-8N]

### Nets
GND: C39.2(-) C40.2ASDF(-) C43.2(-) C44.2(-) C46.2ASDF(-) U12.4(GND1) U13.2(GND1) U13.4(GND1) ; also sheet 1,2,3,4,5,6,7,10,11
GNDB: C38.2(-) C41.2(-) C42.2(-) C45.2ASDF(-) FL9.1 R42.1 ; also sheet 5,6,7,9
ISO-SCL: R41.1 U12.6(SCL2) ; also sheet 9
ISO-SDA: R40.1 U12.7(SDA2) ; also sheet 9
N$41: R42.2 R43.1 U13.8(VSEL)
N$42: C37.2(-) FL9.2 U13.5(GNDISO) U13.7(GNDISO)
N$43: C37.1(+) FL10.2 U13.6(VISO)
PDIS: R44.1 U13.1(PDIS) ; also sheet 2,3
SCL: U12.3(SCL1) ; also sheet 2,3,4,10
SDA: U12.2(SDA1) ; also sheet 2,3,4,10
VDD: C39.1(+) C40.1ASD(+) C43.1(+) C44.1(+) C46.1ASD(+) R44.2 U12.1(VDD1) U13.3(VDDP) ; also sheet 2,3,4,5,6,7,10,11
VISO2: C38.1(+) C41.1(+) C42.1(+) C45.1ASD(+) FL10.1 R40.2 R41.2 R43.2 U12.8(VDD2) ; also sheet 9
Unconnected: U12.5(GND2)

## Sheet 9 of 11
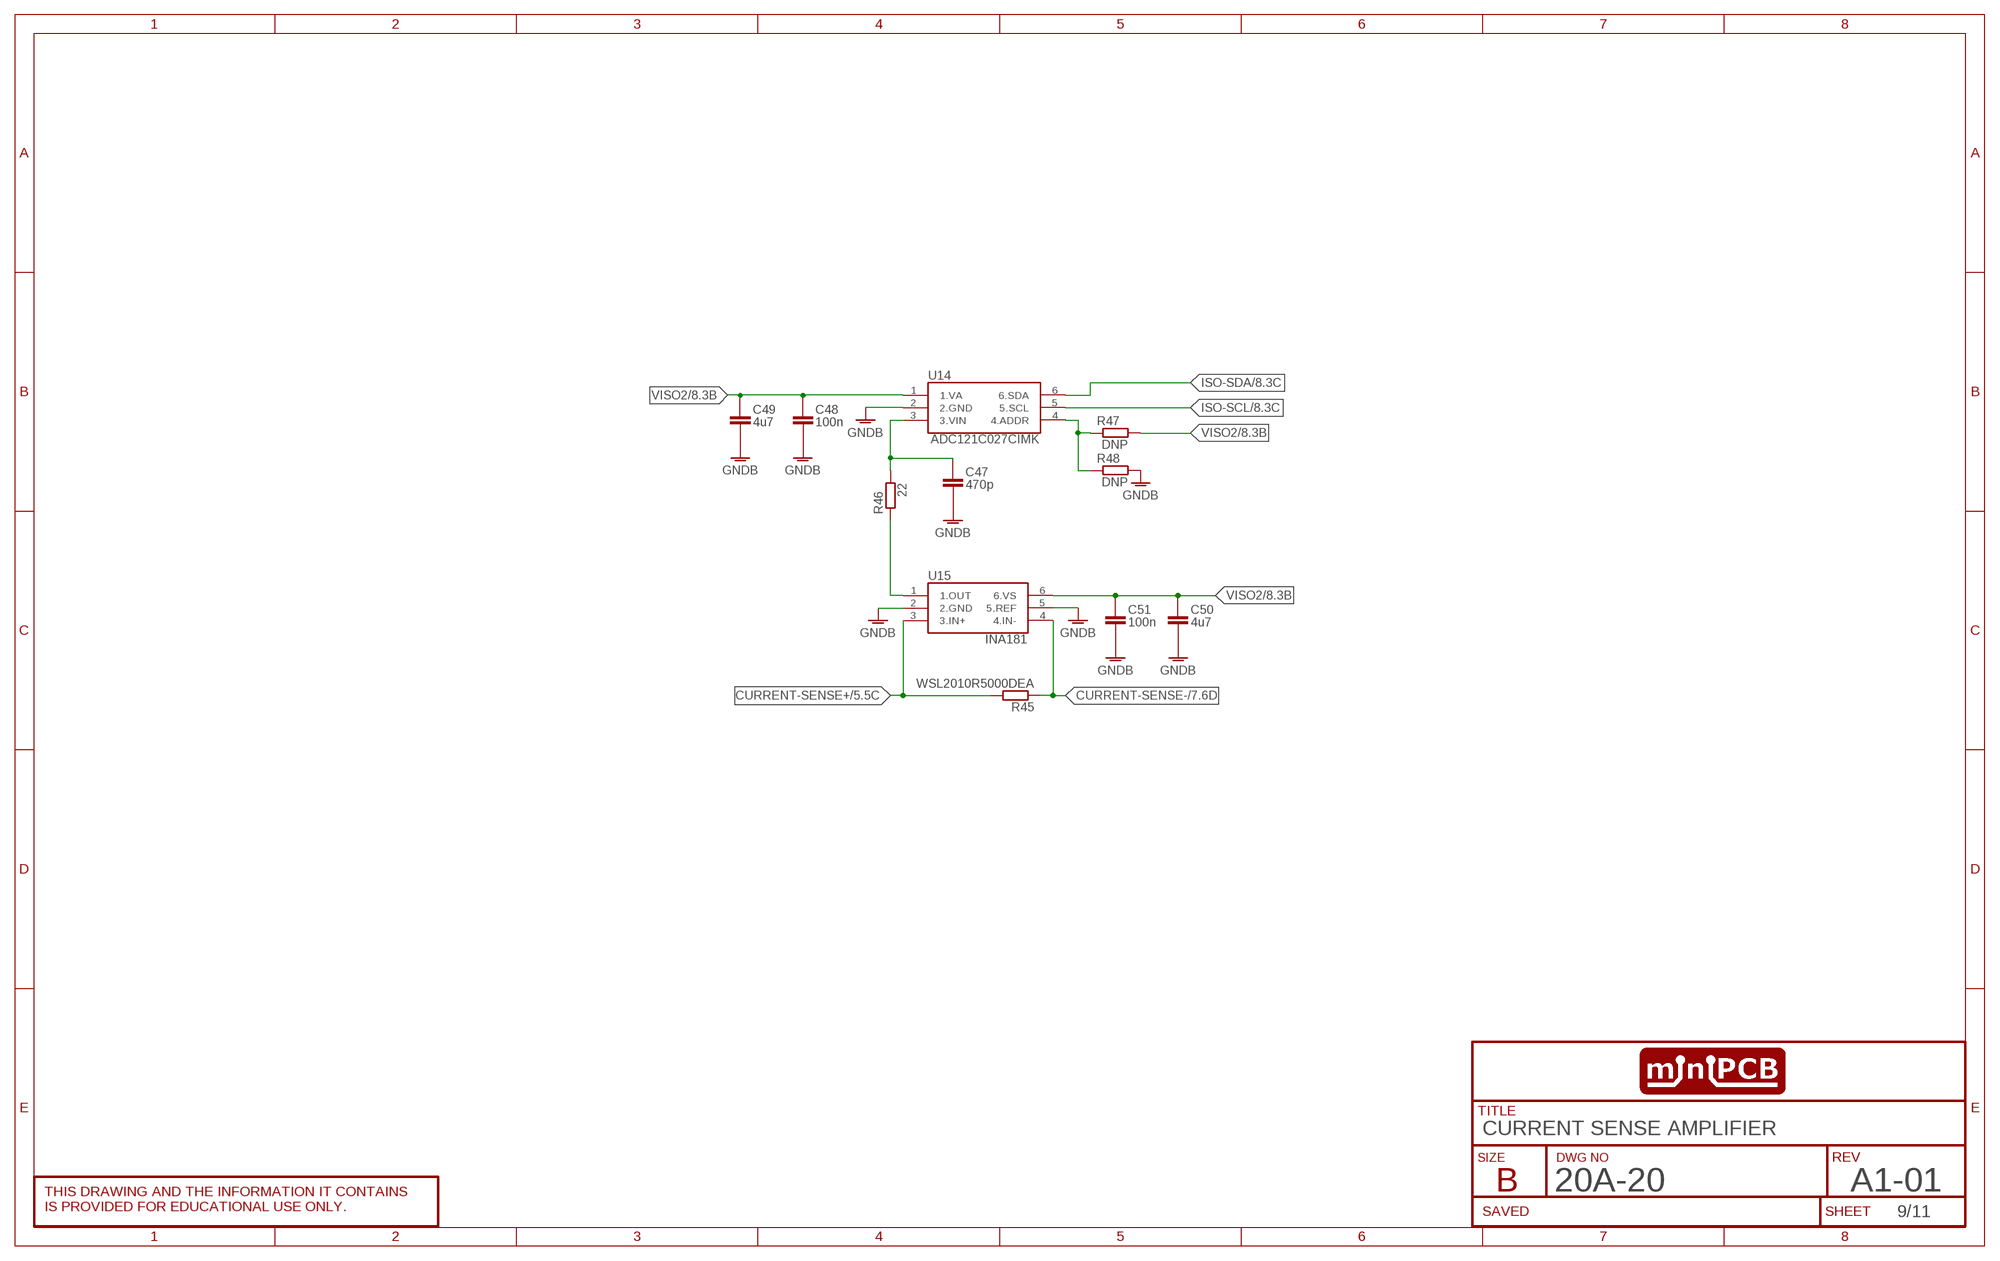
[diagram p8: schematic, sheet 9]
SHEET9 (SCHEMATIC): DWG_NO: 04C-10; REV: A1-01; TITLE: CURRENT SENSE AMPLIFIER

### Parts
C47  470p  CAPACITOR0402  [C0402]
C48  100n  CAPACITOR0402  [C0402]
C49  4u7  CAPACITOR0402  [C0402]
C50  4u7  CAPACITOR0402  [C0402]
C51  100n  CAPACITOR0402  [C0402]
R45  WSL2010R5000DEA  R-EU_R5025  [R5025]
R46  22  RESISTOR0402  [R0402]
R47  DNP  RESISTOR0402  [R0402]
R48  DNP  RESISTOR0402  [R0402]
U14  ADC121C027CIMK  [SOT23-6]
U15  INA181  INAX81  [SOT23-6]

### Nets
CURRENT-SENSE+: R45.2 U15.3(3.IN+) ; also sheet 5,6
CURRENT-SENSE-: R45.1 U15.4(4.IN-) ; also sheet 7
GNDB: C47.2(-) C48.2(-) C49.2(-) C50.2(-) C51.2(-) R48.2 U14.2(2.GND) U15.2(2.GND) U15.5(5.REF) ; also sheet 5,6,7,8
ISO-SCL: U14.5(5.SCL) ; also sheet 8
ISO-SDA: U14.6(6.SDA) ; also sheet 8
N$44: C47.1(+) R46.2 U14.3(3.VIN)
N$45: R46.1 U15.1(1.OUT)
N$46: R47.1 R48.1 U14.4(4.ADDR)
VISO2: C48.1(+) C49.1(+) C50.1(+) C51.1(+) R47.2 U14.1(1.VA) U15.6(6.VS) ; also sheet 8

## Sheet 10 of 11
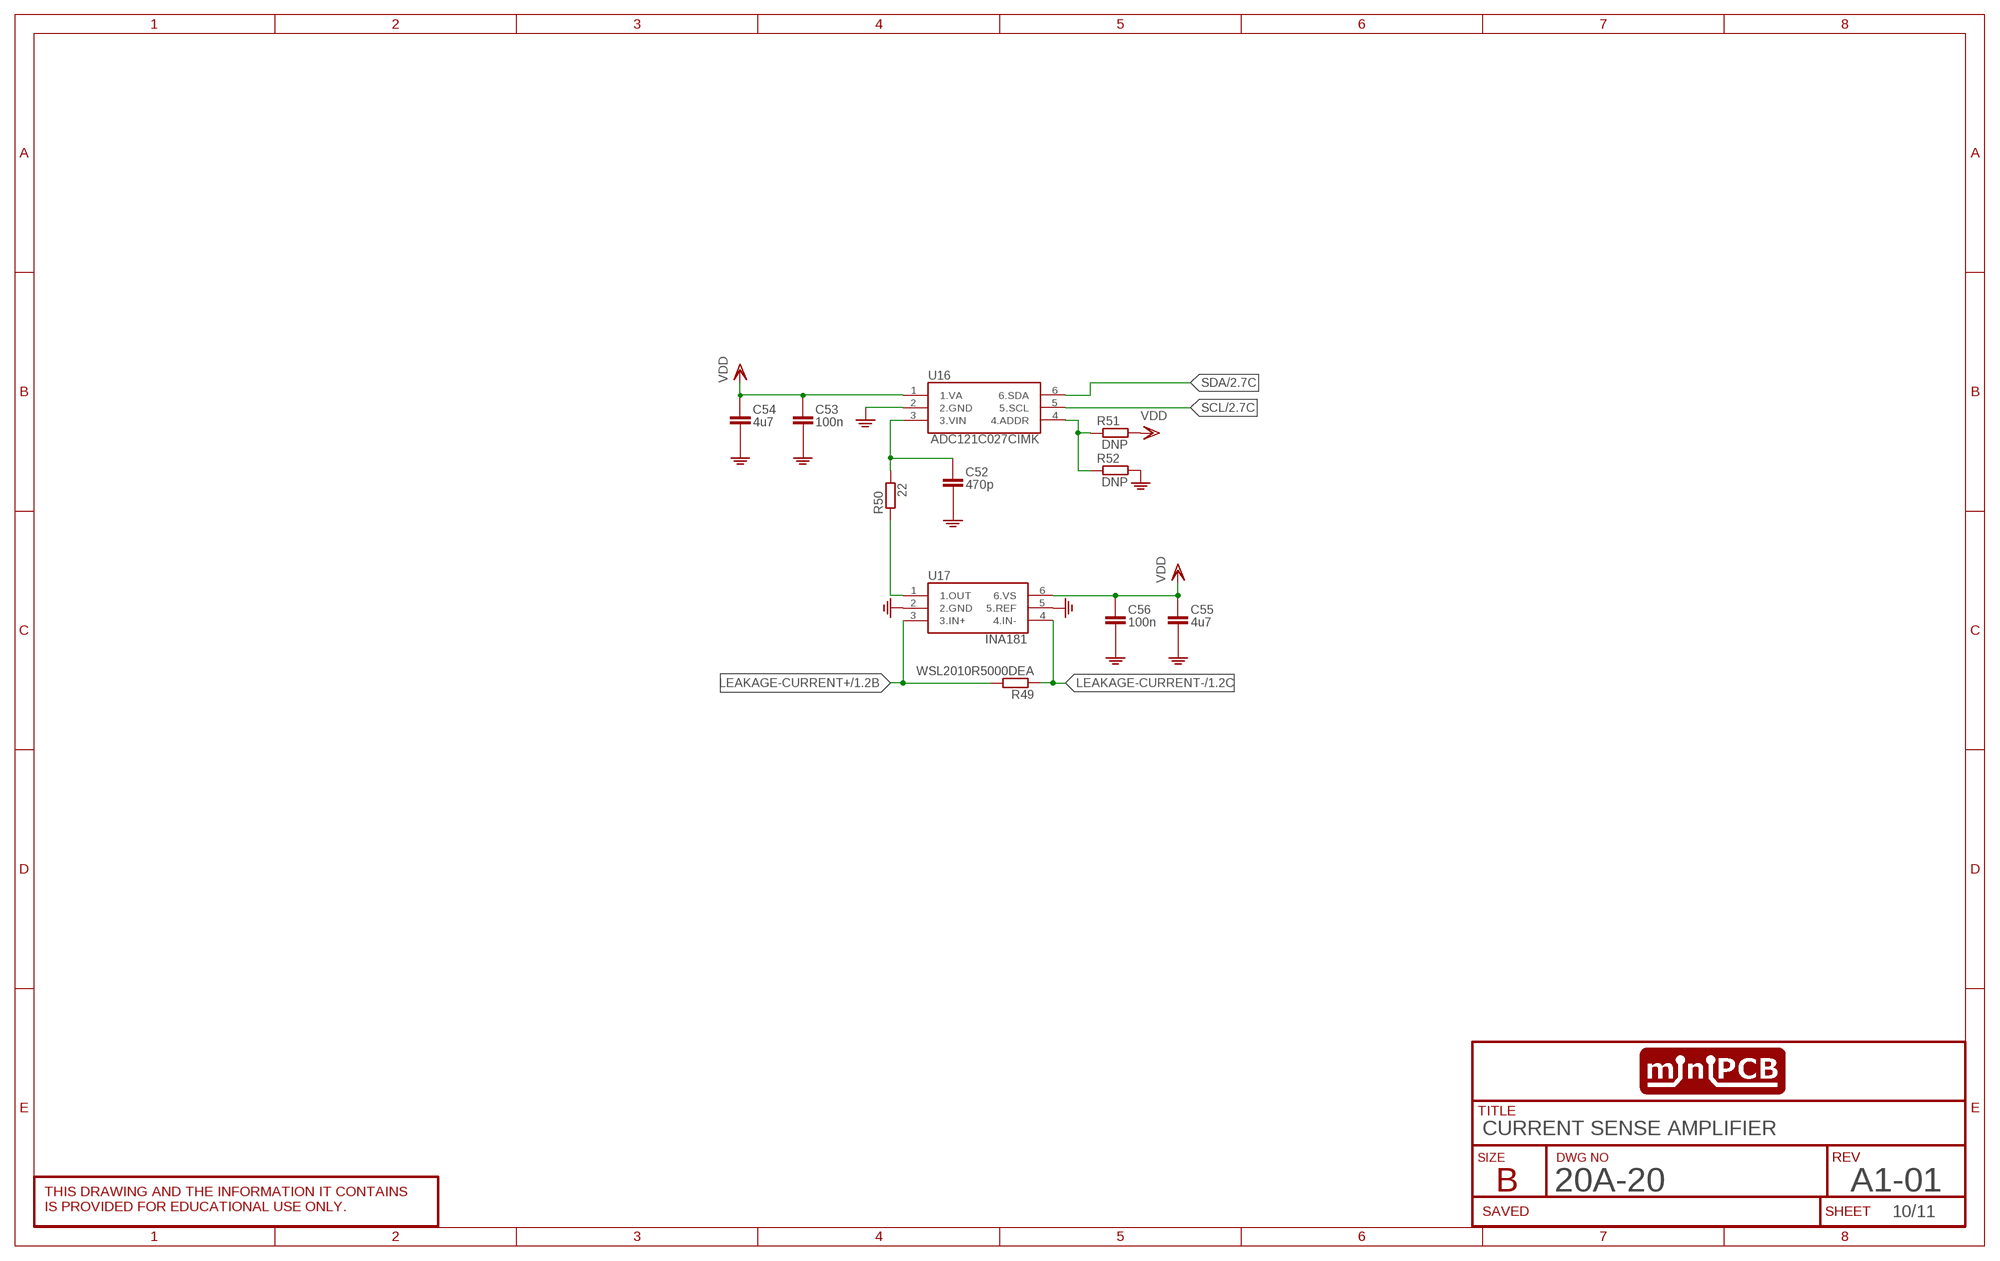
[diagram p9: schematic, sheet 10]
SHEET10 (SCHEMATIC): DWG_NO: 04C-10; REV: A1-01; TITLE: CURRENT SENSE AMPLIFIER

### Parts
C52  470p  CAPACITOR0402  [C0402]
C53  100n  CAPACITOR0402  [C0402]
C54  4u7  CAPACITOR0402  [C0402]
C55  4u7  CAPACITOR0402  [C0402]
C56  100n  CAPACITOR0402  [C0402]
R49  WSL2010R5000DEA  R-EU_R5025  [R5025]
R50  22  RESISTOR0402  [R0402]
R51  DNP  RESISTOR0402  [R0402]
R52  DNP  RESISTOR0402  [R0402]
U16  ADC121C027CIMK  [SOT23-6]
U17  INA181  INAX81  [SOT23-6]

### Nets
GND: C52.2(-) C53.2(-) C54.2(-) C55.2(-) C56.2(-) R52.2 U16.2(2.GND) U17.2(2.GND) U17.5(5.REF) ; also sheet 1,2,3,4,5,6,7,8,11
LEAKAGE-CURRENT+: R49.2 U17.3(3.IN+) ; also sheet 1
LEAKAGE-CURRENT-: R49.1 U17.4(4.IN-) ; also sheet 1
N$47: C52.1(+) R50.2 U16.3(3.VIN)
N$48: R50.1 U17.1(1.OUT)
N$49: R51.1 R52.1 U16.4(4.ADDR)
SCL: U16.5(5.SCL) ; also sheet 2,3,4,8
SDA: U16.6(6.SDA) ; also sheet 2,3,4,8
VDD: C53.1(+) C54.1(+) C55.1(+) C56.1(+) R51.2 U16.1(1.VA) U17.6(6.VS) ; also sheet 2,3,4,5,6,7,8,11

## Sheet 11 of 11
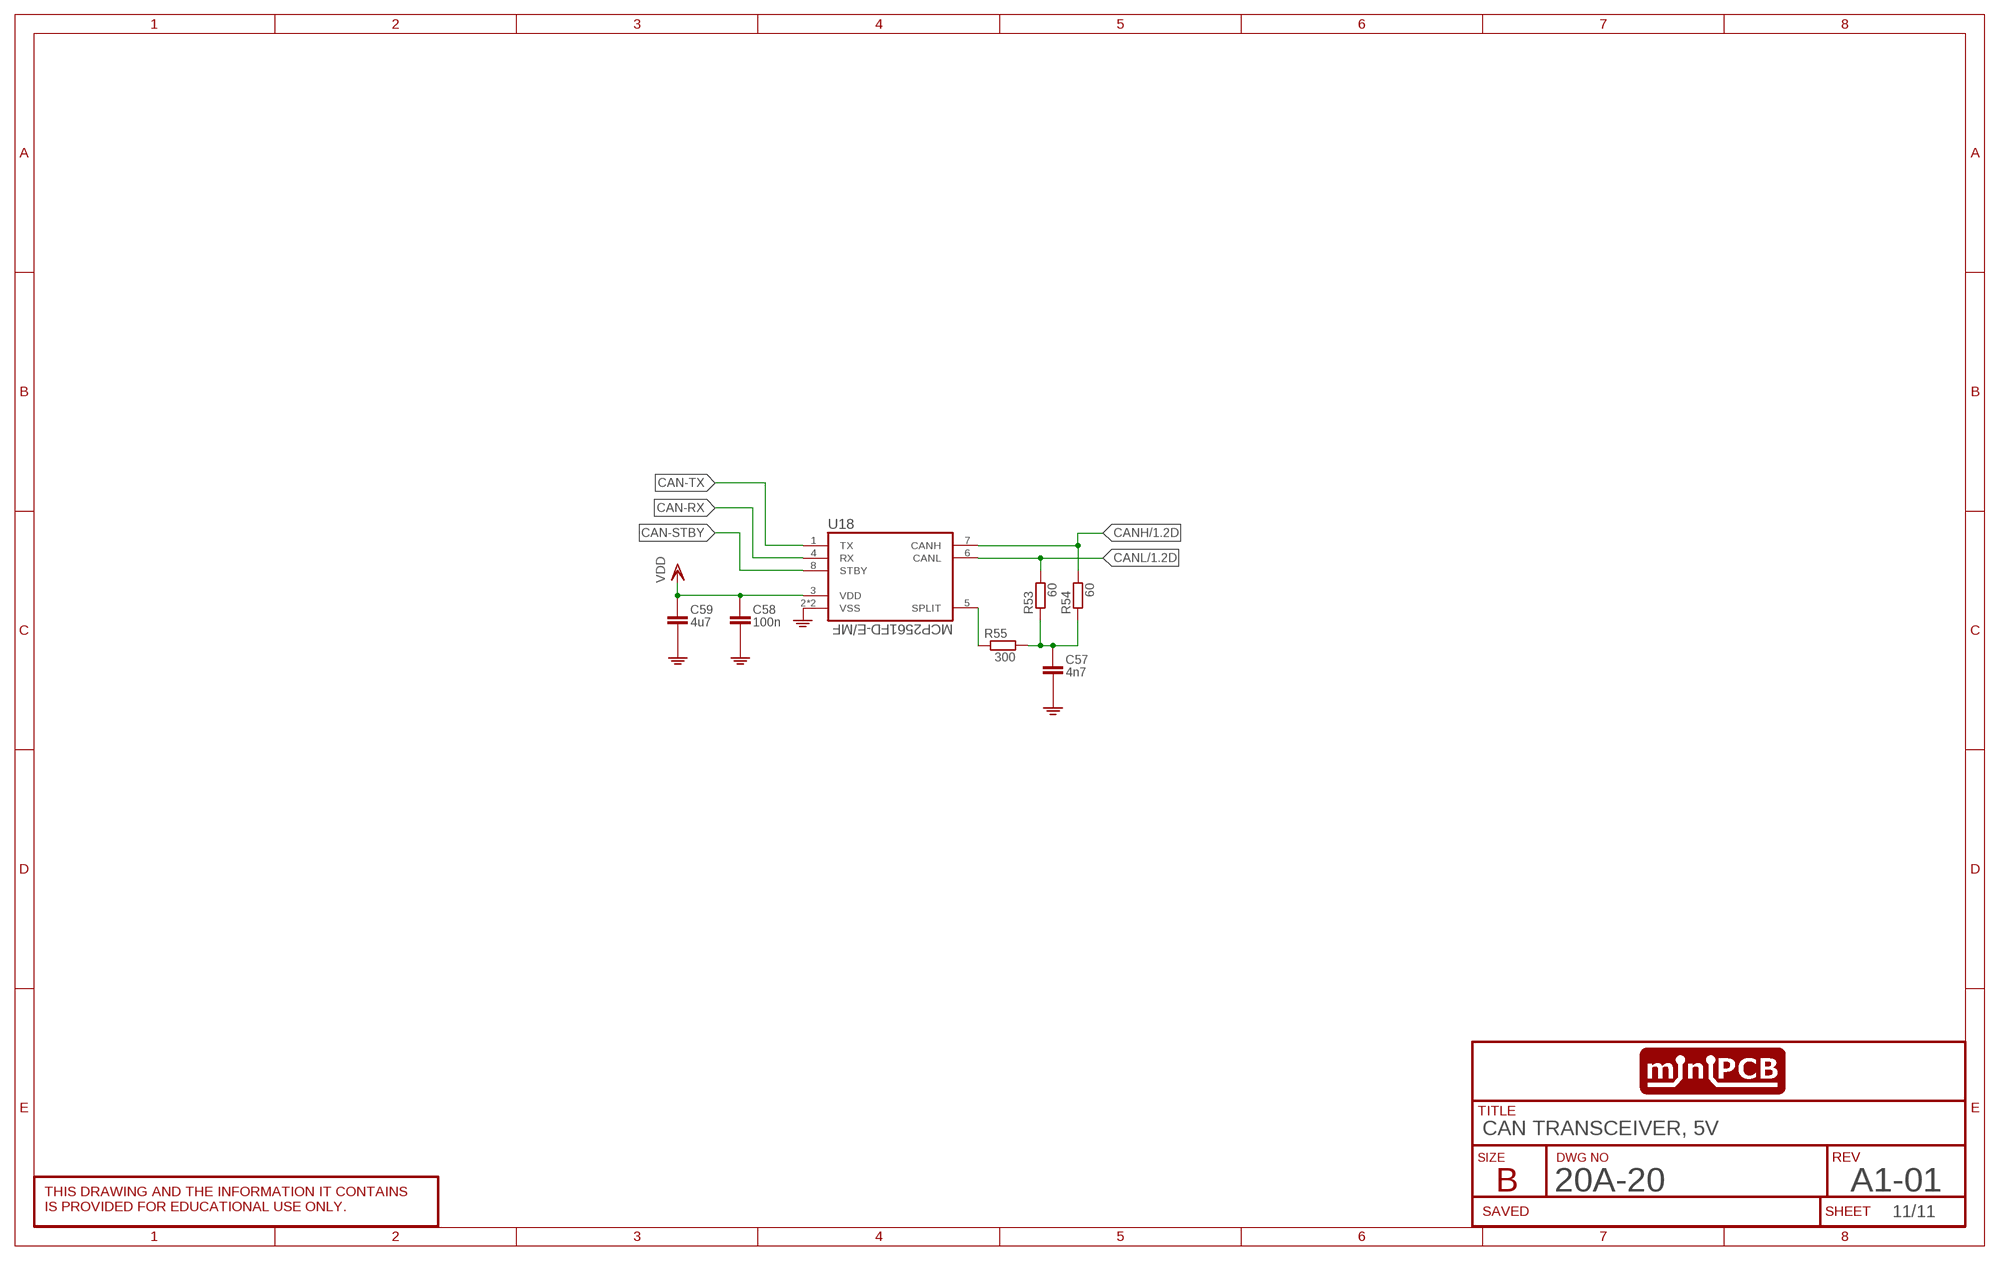
[diagram p10: schematic, sheet 11]
SHEET11 (SCHEMATIC): DWG_NO: 12A-03; REV: A1-01; TITLE: CAN TRANSCEIVER, 5V

### Parts
C57  4n7  CAPACITOR0402  [C0402]
C58  100n  CAPACITOR0402  [C0402]
C59  4u7  CAPACITOR0402  [C0402]
R53  60  RESISTOR0402  [R0402]
R54  60  RESISTOR0402  [R0402]
R55  300  RESISTOR0402  [R0402]
U18  MCP2561FD-E/MF  [SON65P300X300X100-9N]

### Nets
CAN-RX: U18.4(RX)
CAN-STBY: U18.8(STBY)
CAN-TX: U18.1(TX)
CANH: R54.2 U18.7(CANH) ; also sheet 1
CANL: R53.2 U18.6(CANL) ; also sheet 1
GND: C57.2(-) C58.2(-) C59.2(-) U18.2(VSS) U18.9(VSS) ; also sheet 1,2,3,4,5,6,7,8,10
N$52: R55.1 U18.5(SPLIT)
N$53: C57.1(+) R53.1 R54.1 R55.2
VDD: C58.1(+) C59.1(+) U18.3(VDD) ; also sheet 2,3,4,5,6,7,8,10

## Library data of the parts
B3 B4 = nolan-utsa:PUSHBUTTON: Tactile push button switch
C1-C26 C37-C59 = minipcb:CAPACITOR
C27-C29 C32-C35 = utsa:C
C30 C31 C36 = utsa:C-EU: CAPACITOR, European symbol
D1 D2 = minipcb:SDA004-7
D3-D5 = minipcb:ZENER: Z-Diode
D6 = utsa:DIODE-: DIODE
FL1-FL10 = minipcb:BLM03HG601SZ1D: Check availability <https://pricing.snapeda.com/parts/BLM03HG601SZ1D/Murata/view-part?ref=eda>
J1 J2 = minipcb:XE-1109-001
J3 = utsa:PINS_6-2X3_AT; P1: MISO; P2: VDD; P3: SCK; P4: MOSI; P5: RESET; P6: GND
J4 J7 = minipcb:SCREW-TERMINAL; CIRCUIT_CATEGORY: CIRCUIT CATEGORY; REVISION: A1; TITLE: TITLE
J5 J6 = utsa:PINS_2
J8 = utsa:2.1MMJACK: 2.1mm x 5.5mm THM DC jack with internal switch. Digikey part #PJ-102A, 4UCON part #05537 2.1mm x 5.5mm SMT DC jack with internal switch. Digikey part #PJ-002A-SMT, 4UCON part #03267 By microbuilder.eu & adafruit.com
J9 = utsa:PINS_4
K1 = utsa:RZ03-1A4-D005: Shrack; Relay Power PCB 16A SPST-NO 5VDC Check availability <https://pricing.snapeda.com/parts/RZ03-1A4-D005/TE%20Connectivity/view-part?ref=eda>; AVAILABILITY: In Stock; CHECK_PRICES: https://www.snapeda.com/parts/RZ03-1A4-D005/TE+Connectivity+Potter+%2526+Brumfield+Relays/view-part/?ref=eda; DESCRIPTION: Shrack, Relay Power PCB 16A SPST-NO 5VDC | TE Connectivity RZ03-1A4-D005; MF: TE Connectivity; MP: RZ03-1A4-D005; PACKAGE: None; PRICE: None; SNAPEDA_LINK: https://www.snapeda.com/parts/RZ03-1A4-D005/TE+Connectivity+Potter+%2526+Brumfield+Relays/view-part/?ref=snap
LED2 = utsa:LED: LED OSRAM: - CHIPLED LG R971, LG N971, LY N971, LG Q971, LY Q971, LO R971, LY R971 LH N974, LH R974 LS Q976, LO Q976, LY Q976 LO Q996 - Hyper CHIPLED LW Q18S LB Q993, LB Q99A, LB R99A - SideLED LS A670, LO A670, LY A670, LG A670, LP A670 LB A673, LV A673, LT A673, LW A673 LH A674 LY A675 LS A676, LA A676, LO A676, LY A676, LW A676 LS A679, LY A679, LG A679 - Hyper Micro SIDELED® LS Y876, LA Y876, LO Y876, LY Y876 LT Y87S - SmartLED LW L88C, LW L88S LB L89C, LB L89S, LG L890 LS L89K, LO L89K, LY L89K LS L896, LA L896, LO L896, LY L896 - TOPLED LS T670, LO T670, LY T670, LG T670, LP T670 LSG T670, LSP T670, LSY T670, LOP T670, LYG T670 LG T671, LOG T671, LSG T671 LB T673, LV T673, LT T673, LW T673 LH T674 LS T676, LA T676, LO T676, LY T676, LB T676, LH T676, LSB T676, LW T676 LB T67C, LV T67C, LT T67C, LS T67K, LO T67K, LY T67K, LW E67C LS E67B, LA E67B, LO E67B, LY E67B, LB E67C, LV E67C, LT E67C LW T67C LS T679, LY T679, LG T679 LS T770, LO T770, LY T770, LG T770, LP T770 LB T773, LV T773, LT T773, LW T773 LH T774 LS E675, LA E675, LY E675, LS T675 LS T776, LA T776, LO T776, LY T776, LB T776 LHGB T686 LT T68C, LB T68C - Hyper Mini TOPLED® LB M676 - Mini TOPLED Santana® LG M470 LS M47K, LO M47K, LY M47K Source: http://www.osram.convergy.de LUXEON: - LUMILED® LXK2-PW12-R00, LXK2-PW12-S00, LXK2-PW14-U00, LXK2-PW14-V00 LXK2-PM12-R00, LXK2-PM12-S00, LXK2-PM14-U00 LXK2-PE12-Q00, LXK2-PE12-R00, LXK2-PE12-S00, LXK2-PE14-T00, LXK2-PE14-U00 LXK2-PB12-K00, LXK2-PB12-L00, LXK2-PB12-M00, LXK2-PB14-N00, LXK2-PB14-P00, LXK2-PB14-Q00 LXK2-PR12-L00, LXK2-PR12-M00, LXK2-PR14-Q00, LXK2-PR14-R00 LXK2-PD12-Q00, LXK2-PD12-R00, LXK2-PD12-S00 LXK2-PH12-R00, LXK2-PH12-S00 LXK2-PL12-P00, LXK2-PL12-Q00, LXK2-PL12-R00 Source: www.luxeon.com KINGBRIGHT: KA-3528ASYC Source: www.kingbright.com
P1-P4 = minipcb:PINS_1
PCB1 = miniPCB_BOARDS:MINIPCB_0P; CIRCUIT_CATEGORY: CIRCUIT CATEGORY; PART_NUMBER: 20A-20; REVISION: A1; TITLE: TITLE
Q1-Q3 = minipcb:MOSFET-N
R1-R24 R31-R44 R46-R48 R50-R55 = minipcb:RESISTOR
R25-R30 R45 R49 = utsa:R-EU_: RESISTOR, European symbol
U1 U5 = 16A-01:MCP9600T-I/MX: MCP9600 Series Thermocouple Electromotive Force to ±1.5°C Converter - VQFN-2 Check availability <https://pricing.snapeda.com/parts/MCP9600T-I/MX/Microchip%20Technology/view-part?ref=eda>; AVAILABILITY: In Stock; CHECK_PRICES: https://www.snapeda.com/parts/MCP9600T-I/MX/Microchip/view-part/?ref=eda; DESCRIPTION: IC THRMOCPLE TO DIG CONV 20MQFN; MF: Microchip Technology; MP: MCP9600T-I/MX; PACKAGE: VQFN-20 Microchip; PRICE: None; SNAPEDA_LINK: https://www.snapeda.com/parts/MCP9600T-I/MX/Microchip/view-part/?ref=snap
U2 U4 U12 = 16A-01:ADUM1250ARZ: Hot Swappable, Dual I2C Isolators Check availability <https://pricing.snapeda.com/parts/ADUM1250ARZ/Analog%20Devices/view-part?ref=eda>; AVAILABILITY: In Stock; CHECK_PRICES: https://www.snapeda.com/parts/ADUM1250ARZ/Analog+Devices/view-part/?ref=eda; DESCRIPTION: Hot Swappable Dual I2C Isolator; MF: Analog Devices; MP: ADUM1250ARZ; PACKAGE: SOIC-8 Analog Devices; PRICE: None; SNAPEDA_LINK: https://www.snapeda.com/parts/ADUM1250ARZ/Analog+Devices/view-part/?ref=snap
U3 U6 U13 = 16A-01:ADUM6280
U7 = utsa:ATMEGA328-AU; COPYRIGHT: Copyright (C) 2021 Ultra Librarian. All rights reserved.; MANUFACTURER_PART_NUMBER: ATMEGA328-AU; MFR_NAME: Microchip
U8 = utsa:VIVA_USB-TTL
U9-U11 = minipcb:TLP181(GB,F): Check availability <https://pricing.snapeda.com/parts/TLP181%28GB%2CF%29/Toshiba/view-part?ref=eda>; AVAILABILITY: In Stock; CHECK_PRICES: https://www.snapeda.com/parts/TLP181(GB,F)/Toshiba/view-part/?ref=eda; DESCRIPTION: Optocouplers/Optoisolators, trans, Optoelectronics, optocoupler; MF: Toshiba; MP: TLP181(GB,F); PACKAGE: SO-4 Toshiba; PRICE: None; SNAPEDA_LINK: https://www.snapeda.com/parts/TLP181(GB,F)/Toshiba/view-part/?ref=snap
U14 U16 = utsa:ADC121C027
U15 U17 = utsa:INAX81: INAx181 Bidirectional, Low- and High-Side Voltage Output, Current-Sense Amplifier
U18 = utsa:MCP2561FD-E/MF
Y1 = utsa:CRYSTAL: HC49S Crystal Oscillator

## Board
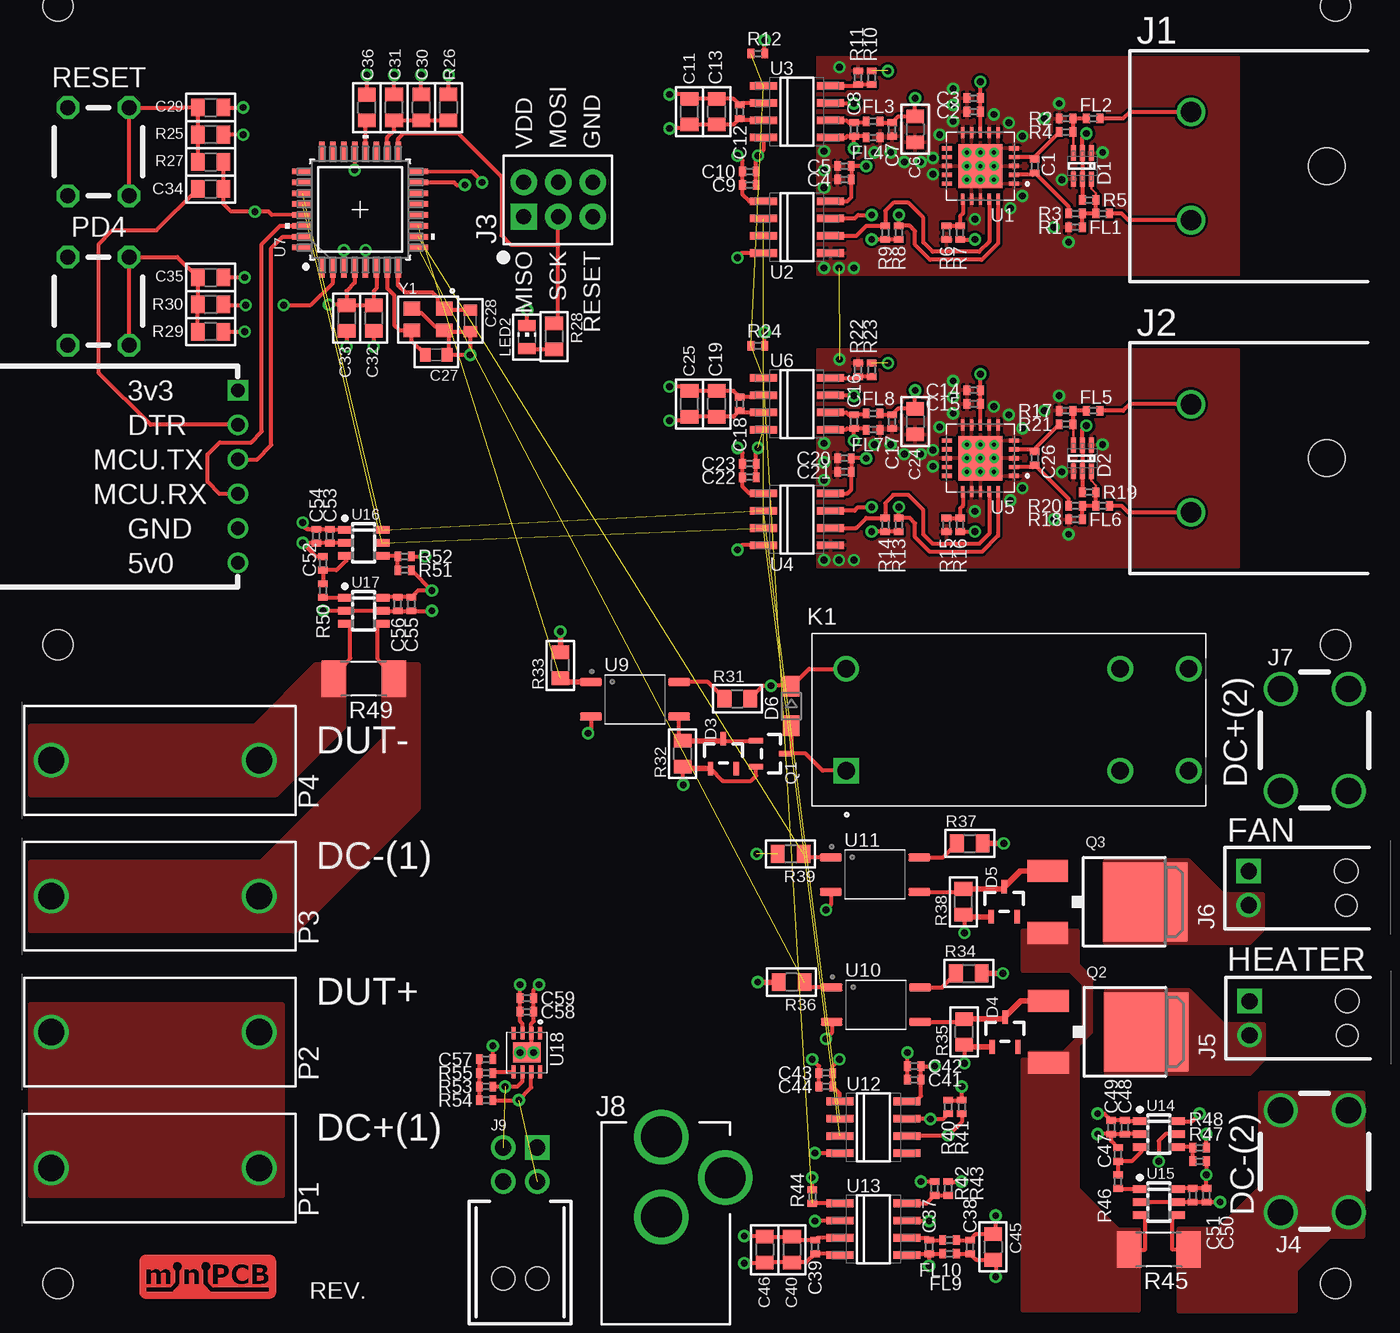
[diagram p11: board, top side]
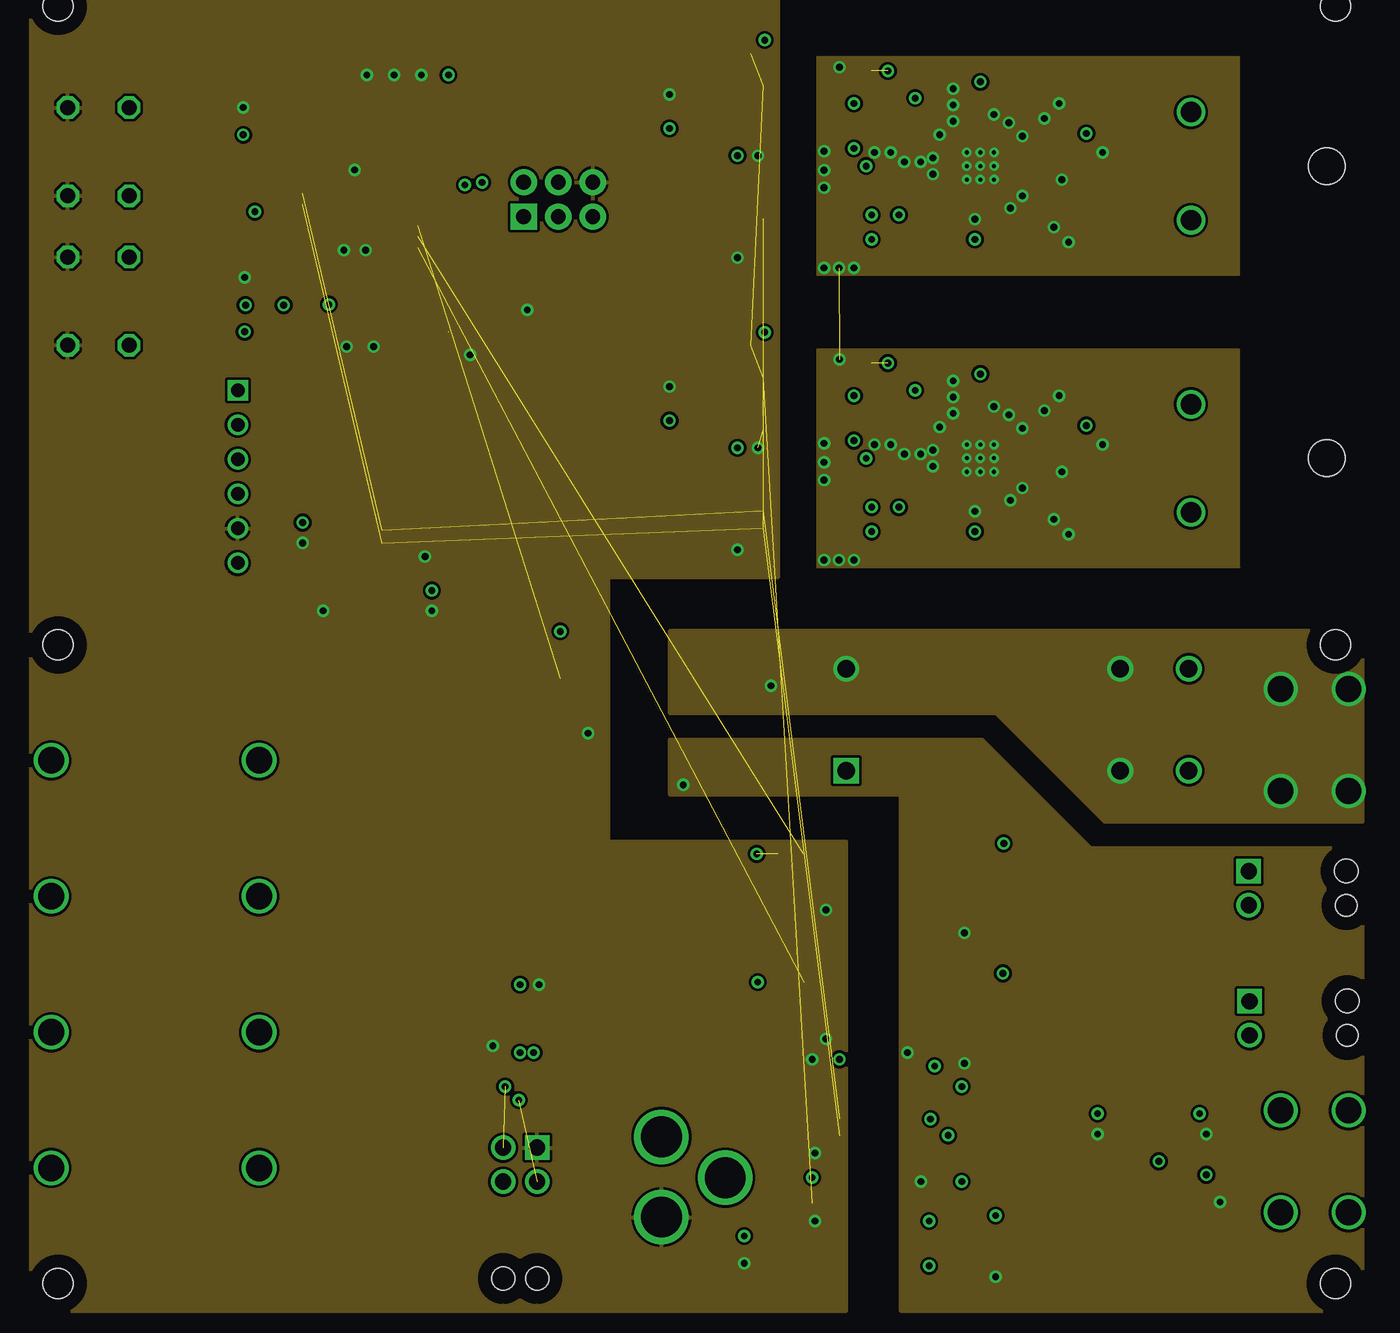
[diagram p12: board, inner layer Route2]
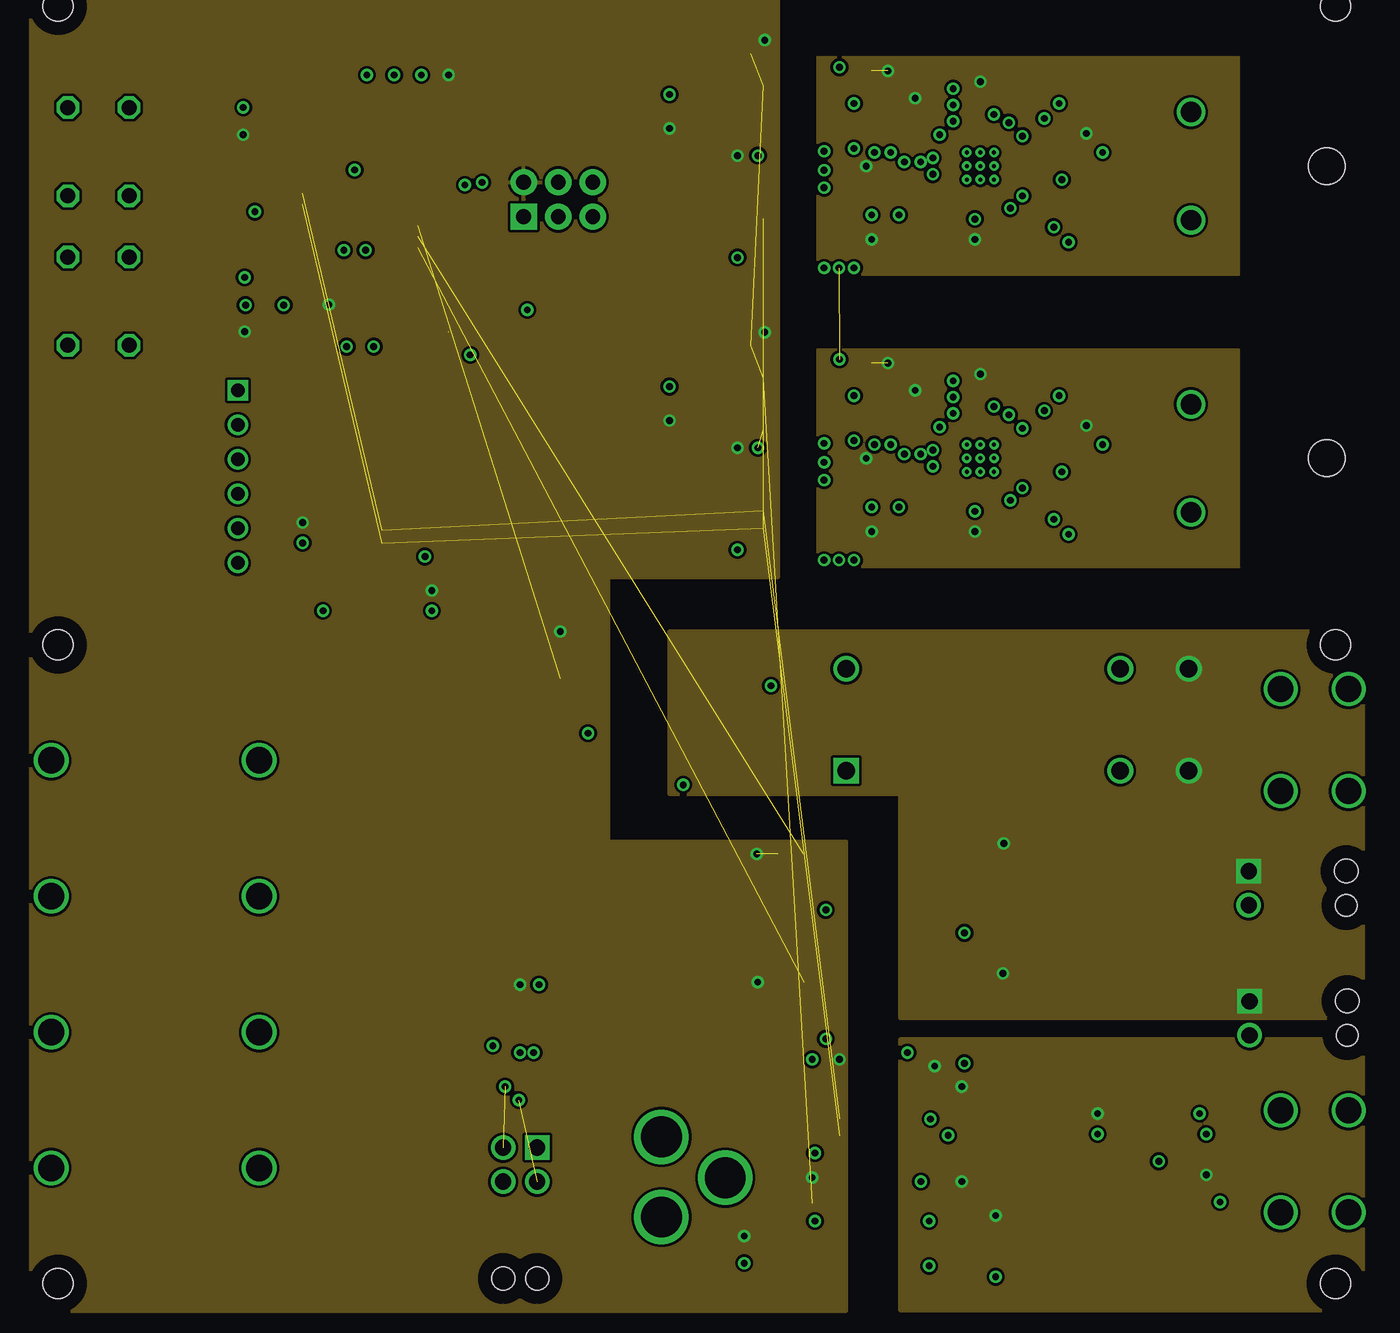
[diagram p13: board, inner layer Route15]
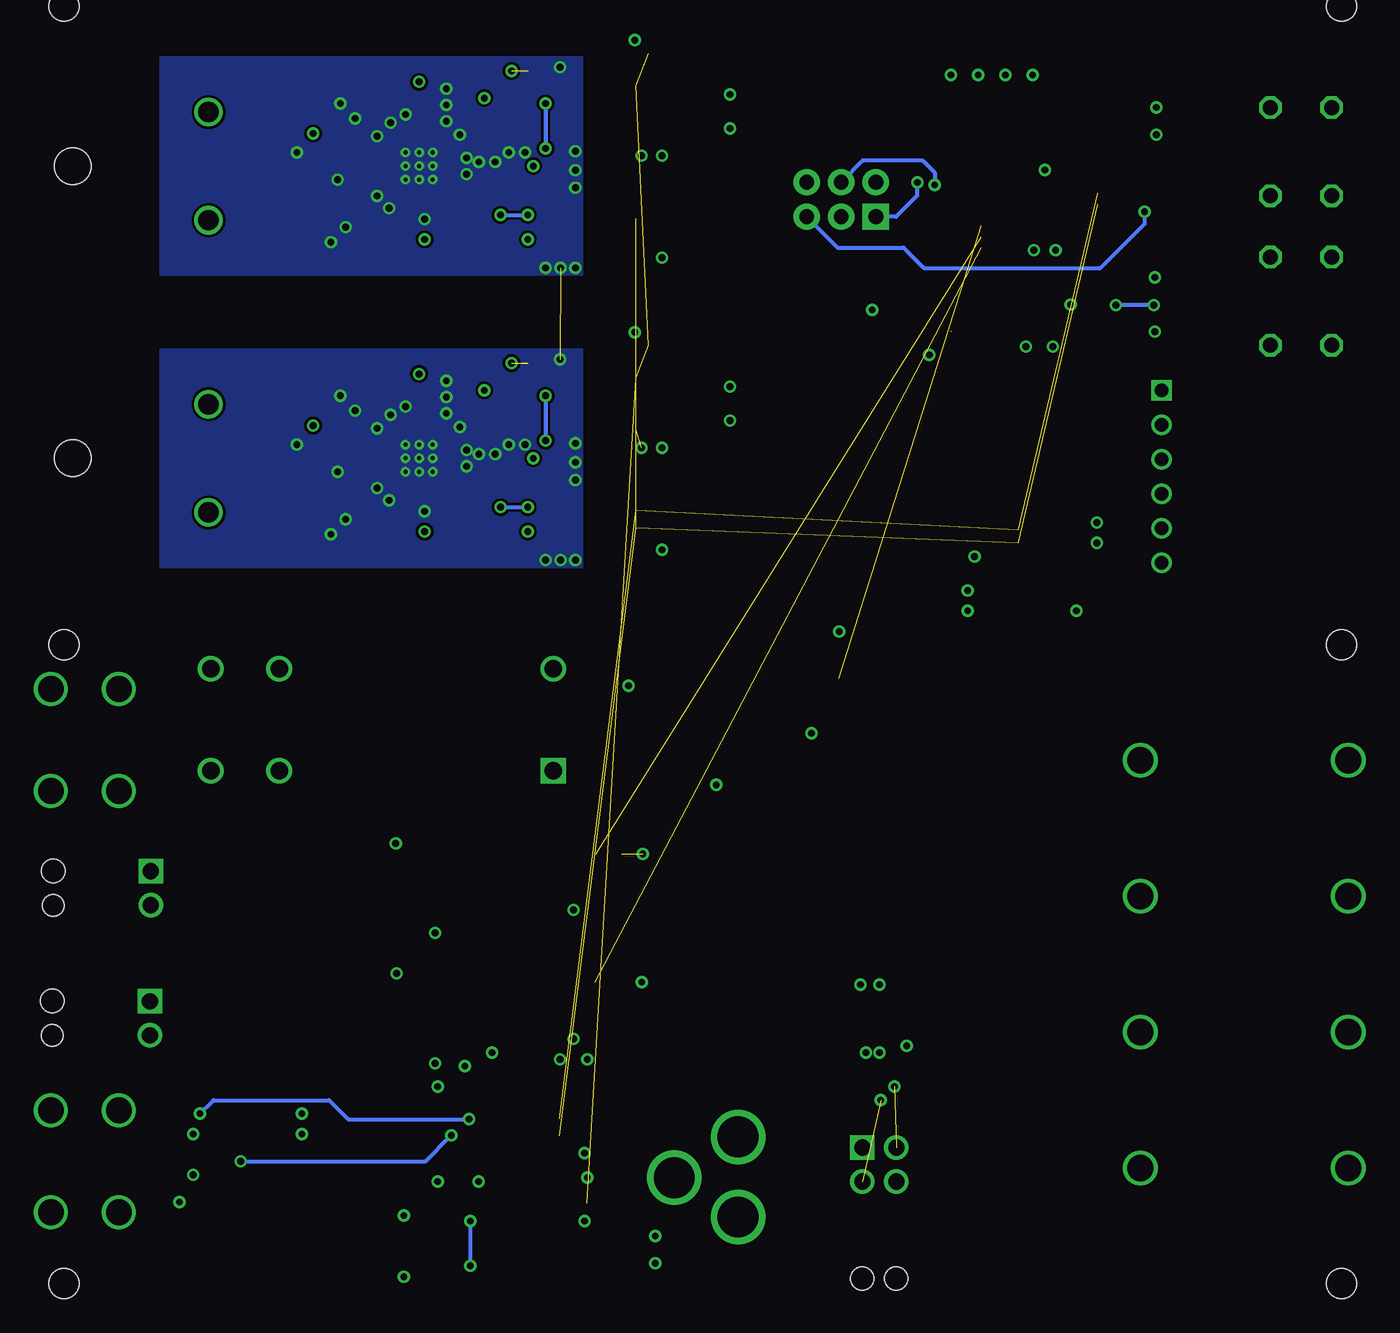
[diagram p14: board, bottom side, seen from below]

No outline drawn. Coordinates in mm, seen from the top.
Copper layers (1+2*15+16): Top 0.035mm / dielectric 0.15mm / Route2 0.035mm / dielectric 0.15mm / Route15 0.035mm / dielectric 0.2mm / Bottom 0.035mm
Design rules "minipcb-SMD-4L": minimum track width 0.25mm, minimum drill 0.5mm, track to track 0.2mm, track to pad 0.2mm, pad to pad 0.15mm, via to via 0.2mm, smd to smd 0.15mm, copper to edge 1mm, drill to drill 1mm, minimum pad ring 0.2mm, minimum via ring 0.2mm, stop-mask expansion 0.1mm, vias tented up to drill 0.55mm, thermal gap 0.2mm

### Footprints (pad centres in the part's own frame; a part is rotated, then mirrored left to right if it is on the bottom)
6X6MM = drill 1.1 octagon: 1.A 0,0; 2.A 6.5,0; 3.B 0,4.5; 4.B 6.5,4.5
C0402 = smd 0.5 x 0.7: 1 -0.5,0; 2 0.5,0
C0805 = smd 1 x 1.3: 1ASD -0.95,0; 2ASDF 0.95,0
C0603 = smd 0.8 x 1: 1 -0.8,0; 2 0.8,0
C0805' = smd 1 x 1.3: 1 -0.95,0; 2 0.95,0
SOT363 = smd 1.118 x 0.356: 1 -0.965,0.66; 2 -0.965,0; 3 -0.965,-0.66; 4 0.965,-0.66; 5 0.965,0; 6 0.965,0.66
SOT23 = smd 0.4 x 1: 1 -0.95,-1.1; 2 0.95,-1.1; 3 0,1.1
SOD323-W = smd 1.5 x 1.2: A 1.45,0; C -1.45,0
R0402 = smd 0.5 x 0.7: 1 -0.5,0; 2 0.5,0
XE-1109-001 = drill 1.5: 1 0,3.98; 2 0,-3.98 | hole 2.7: 10,0
PINS_6-2X3_AT = drill 1.1 pad 1.93 square: 1 0,0 | drill 1.1 pad 1.93: 2 2.54,0; 3 0,-2.54; 4 2.54,-2.54; 5 0,-5.08; 6 2.54,-5.08
SCREW-TERMINAL-M3 = drill 1.9: 1 -2.5,3.75; 2 2.5,3.75; 3 -2.5,-3.75; 4 2.5,-3.75
PINS_2-NANOFIT-H = drill 1.2 square: 1 -1.25,0 | drill 1.2: 2 1.25,0 | hole 1.6: 1.27,7.18 | hole 1.75: -1.27,7.18
PJ-102A = drill 3 pad 4: RING 0.1,-3.39; RING_SW -4.6,-6.29; TIP 0.1,-9.29
PINS_4_NANOFIT_RA = drill 1.2 square: 1 1.25,0 | drill 1.2: 2 -1.25,0; 3 1.25,-2.5; 4 -1.25,-2.5 | hole 1.7: -1.25,-9.62; 1.25,-9.62
RELAY_RZ03-1A4-D005 = drill 1.3: 11.1 8.2,-3.75; 11.2 8.2,3.75; 14.1 13.24,-3.75; 14.2 13.24,3.75; A2 -11.96,3.75 | drill 1.3 square: A1 -11.96,-3.75
SML0805 = smd 0.8 x 1.27: A -0.9,0; C 0.8,0
BANNAN_JACK_4MM_H = drill 1.94: 1 0,0; 2 -15.3,0
MINIPCB_DOCK_100X100 = hole 2.2: 3,97; 3,50; 3,3; 97,3; 97,50; 97,97
DPACK = smd 1.6 x 3: 1 -2.28,-4.8; 3 2.28,-4.8 | smd 5.8 x 6.2: 4 0,2.38
R0805 = smd 1 x 1.3: 1 -0.95,0; 2 0.95,0
R5025 = smd 1.8 x 2.7: 1 -2.2,0; 2 2.2,0
QFN65P500X500X100-21N_MCP9600T-I/MX = smd 0.81 x 0.32: 1 -2.45,1.3; 2 -2.45,0.65; 3 -2.45,0; 4 -2.45,-0.65; 5 -2.45,-1.3; 11 2.45,-1.3; 12 2.45,-0.65; 13 2.45,0; 14 2.45,0.65; 15 2.45,1.3 | smd 0.32 x 0.81: 6 -1.3,-2.45; 7 -0.65,-2.45; 8 0,-2.45; 9 0.65,-2.45; 10 1.3,-2.45; 16 1.3,2.45; 17 0.65,2.45; 18 0,2.45; 19 -0.65,2.45; 20 -1.3,2.45 | smd 3.25 x 3.25: 21 0,0 | drill 0.3 pad 0.5: 22 -1,1; 23 0,1; 24 1,1; 25 -1,0; 26 0,0; 27 1,0; 28 -1,-1; 29 0,-1; 30 1,-1
SOIC127P600X175-8N = smd 1.981 x 0.559: 1 -2.464,1.905; 2 -2.464,0.635; 3 -2.464,-0.635; 4 -2.464,-1.905; 5 2.464,-1.905; 6 2.464,-0.635; 7 2.464,0.635; 8 2.464,1.905
32A_ATM = smd 1.5 x 0.4: 1 -4.25,2.8; 2 -4.25,2; 3 -4.25,1.2; 4 -4.25,0.4; 5 -4.25,-0.4; 6 -4.25,-1.2; 7 -4.25,-2; 8 -4.25,-2.8; 17 4.25,-2.8; 18 4.25,-2; 19 4.25,-1.2; 20 4.25,-0.4; 21 4.25,0.4; 22 4.25,1.2; 23 4.25,2; 24 4.25,2.8 | smd 0.4 x 1.5: 9 -2.8,-4.25; 10 -2,-4.25; 11 -1.2,-4.25; 12 -0.4,-4.25; 13 0.4,-4.25; 14 1.2,-4.25; 15 2,-4.25; 16 2.8,-4.25; 25 2.8,4.25; 26 2,4.25; 27 1.2,4.25; 28 0.4,4.25; 29 -0.4,4.25; 30 -1.2,4.25; 31 -2,4.25; 32 -2.8,4.25
VIVA_USB_TTL_SUBTEXT = drill 1 square: 1.3V3 0,0 | drill 1: 2.DTR 0,-2.54; 3.RXI 0,-5.08; 4.RDO 0,-7.62; 5.GND 0,-10.16; 6.5V 0,-12.7
SOIC254P700X280-4N = smd 1.61 x 0.57: 1 -3.25,1.27; 3 -3.25,-1.27; 4 3.25,-1.27; 6 3.25,1.27
SOT23-6 = smd 0.55 x 1.2: 1 -0.95,-1.3; 2 0,-1.3; 3 0.95,-1.3; 4 0.95,1.3; 5 0,1.3; 6 -0.95,1.3
SON65P300X300X100-9N = smd 0.87 x 0.32: 1 -1.42,0.975; 2 -1.42,0.325; 3 -1.42,-0.325; 4 -1.42,-0.975; 5 1.42,-0.975; 6 1.42,-0.325; 7 1.42,0.325; 8 1.42,0.975 | smd 1.47 x 2: 9 0,0
TXC7M2 = smd 1.2 x 1: 1 -1.2,-0.8; 2 1.2,-0.8; 3 1.2,0.8; 4 -1.2,0.8

### Placement (x,y rotation side)
B3  3.73,78.54 270 top
B4  3.73,89.54 270 top
C1  74.87,85.23 90 top
C2  70.37,89.23 0 top
C3  70.37,90.23 0 top
C4  60.87,84.23 180 top
C5  60.87,85.23 180 top
C6  66.07,87.93 270 top
C7  64.37,87.93 270 top
C8  61.57,87.93 270 top
C9  53.87,83.83 0 top
C10  53.87,84.83 0 top
C11  49.47,89.23 90 top
C12  53.17,89.23 90 top
C13  51.47,89.23 90 top
C14  70.37,68.73 0 top
C15  70.37,67.73 0 top
C16  61.57,66.43 270 top
C17  64.37,66.43 270 top
C18  53.17,67.73 90 top
C19  51.47,67.73 90 top
C20  60.87,63.73 180 top
C21  60.87,62.73 180 top
C22  53.87,62.33 0 top
C23  53.87,63.33 0 top
C24  66.07,66.43 270 top
C25  49.47,67.73 90 top
C26  74.87,63.73 90 top
C27  30.83,71.34 180 top
C28  33.33,73.84 90 top
C29  100n  [C0805']  14.23,89.54 0 top
C30  1u  [C0805']  29.73,89.54 90 top
C31  100p  [C0805']  27.73,89.54 90 top
C32  1u  [C0805']  26.23,74.04 270 top
C33  10u  [C0805']  24.23,74.04 270 top
C34  100n  [C0805']  14.23,83.54 0 top
C35  100n  [C0805']  14.23,77.04 0 top
C36  1u  [C0805']  25.73,89.53 90 top
C37  67.1,5.7 270 top
C38  70.1,5.7 270 top
C39  58.7,5.7 270 top
C40  57,5.5 270 top
C41  66,18 180 top
C42  66,19 180 top
C43  59.5,18.5 180 top
C44  59.5,17.5 180 top
C45  71.8,5.7 270 top
C46  55,5.5 270 top
C47  81,12.5 90 top
C48  81.5,14.5 270 top
C49  80.5,14.5 270 top
C50  87.5,9.5 270 top
C51  86.5,9.5 270 top
C52  22.5,56 90 top
C53  23,58 270 top
C54  22,58 270 top
C55  29,53 270 top
C56  28,53 270 top
C57  34.5,19.5 0 top
C58  37.5,23 0 top
C59  37.5,24 0 top
D1  78.37,85.23 270 top
D2  78.37,63.73 270 top
D3  51.96,41.99 0 top
D4  72.68,21.52 0 top
D5  72.62,31.09 0 top
D6  56.96,45.49 270 top
FL1  79.87,81.73 180 top
FL2  79.17,88.73 180 top
FL3  62.97,88.53 180 top
FL4  62.97,87.33 180 top
FL5  79.17,67.23 180 top
FL6  79.87,60.23 180 top
FL7  62.97,65.83 180 top
FL8  62.97,67.03 180 top
FL9  68.6,5.2 180 top
FL10  68.6,6.2 180 top
J1  86.37,85.23 0 top
J2  86.37,63.73 0 top
J3  37.27,81.5 90 top
J4  95.46,11.99 180 top
J5  90.68,22.52 270 top
J6  90.62,32.09 270 top
J7  95.46,42.99 180 top
J8  47.5,4.5 180 top
J9  37,13 0 top
K1  72.96,44.49 0 top
LED2  37.5,72.69 90 top
P1  2.5,11.5 180 top
P2  2.5,21.5 180 top
P3  2.5,31.5 180 top
P4  2.5,41.5 180 top
PCB1  0,0 0 top
Q1  55.46,41.99 270 top
Q2  80.68,21.52 270 top
Q3  80.62,31.09 270 top
R1  77.87,80.73 0 top
R2  77.17,88.73 0 top
R3  77.87,81.73 180 top
R4  77.17,87.73 180 top
R5  78.87,82.73 180 top
R6  68.37,80.33 90 top
R7  69.37,80.33 270 top
R8  64.87,80.33 270 top
R9  63.87,80.33 270 top
R10  62.87,91.73 90 top
R11  61.87,91.73 270 top
R12  54.5,93.5 0 top
R13  64.87,58.83 270 top
R14  63.87,58.83 270 top
R15  68.37,58.83 90 top
R16  69.37,58.83 270 top
R17  77.17,67.23 0 top
R18  77.87,59.23 0 top
R19  78.87,61.23 180 top
R20  77.87,60.23 180 top
R21  77.17,66.23 180 top
R22  61.87,70.23 270 top
R23  62.87,70.23 90 top
R24  54.5,72 0 top
R25  14.23,87.54 180 top
R26  31.73,89.54 270 top
R27  14.23,85.54 0 top
R28  39.5,72.69 270 top
R29  14.23,73.04 180 top
R30  14.23,75.04 180 top
R31  52.99,46.04 0 top
R32  48.96,41.99 90 top
R33  39.96,48.49 90 top
R34  70.02,25.82 0 top
R35  69.68,21.52 90 top
R36  56.98,25.18 180 top
R37  70.09,35.38 0 top
R38  69.62,31.09 90 top
R39  56.91,34.62 180 top
R40  68.5,16 90 top
R41  69.5,16 90 top
R42  67.5,10 270 top
R43  68.5,10 90 top
R44  58.5,9.4 90 top
R45  84,5.5 180 top
R46  81,10.5 90 top
R47  87,12 0 top
R48  87,13 0 top
R49  25.5,47.5 180 top
R50  22.5,54 90 top
R51  28.5,55.5 0 top
R52  28.5,56.5 0 top
R53  34.5,17.5 0 top
R54  34.5,16.5 0 top
R55  34.5,18.5 180 top
U1  70.87,85.23 180 top
U2  57.37,80.73 0 top
U3  57.37,89.23 0 top
U4  57.37,59.23 0 top
U5  70.87,63.73 180 top
U6  57.37,67.73 0 top
U7  25.23,82.03 90 top
U8  16.23,68.73 0 top
U9  45.46,45.99 0 top
U10  63.18,23.52 0 top
U11  63.12,33.09 0 top
U12  63,14.5 0 top
U13  63,7 0 top
U14  84,14 270 top
U15  84,9 270 top
U16  25.5,57.5 270 top
U17  25.5,52.5 270 top
U18  37.5,20 270 top
Y1  30.23,73.94 180 top

### Tracks (layer width: path | path; a pad name or v marks a point on that pad's centre or on a via)
AT_DTR_CAP
  Top 0.3: U8.2.DTR 9.81,66.19 6,70 6,79.5 7,80.5 10.24,80.5 C34.1
AT_MISO  (via drill 0.5 pad 0.9)
  Top 0.3: U7.16 33.43,84.84 34.23,84.04 v34.21,84.02
  Bottom 0.3: v34.21,84.02 34.23,84 34.23,83.04 35.77,81.5 J3.1
AT_MOSI  (via drill 0.5 pad 0.9)
  Top 0.3: U7.15 32.13,84.04 32.33,83.84 v32.93,83.84
  Bottom 0.3: J3.4 38.2,85.66 33.84,85.66 32.93,84.74 v32.93,83.84
AT_RST  (via drill 0.5 pad 0.9)
  Top 0.3: R27.2 C34.2 15.18,82.44 15.74,81.88 v17.48,81.88 18.49,81.88 18.73,81.64 U7.29
  Bottom 0.3: J3.5 40.08,79.23 35.23,79.23 33.73,77.73 20.73,77.73 17.48,80.98 v17.48,81.88
AT_RST_CAP
  Top 0.3: C29.1 12.23,89.54 | C29.1 R27.1 | C29.1 R25.2 | 12.23,89.54 B4.3.B B4.4.B | 12.23,89.54
AT_RXD
  Top 0.3: U8.4.RDO 14.89,61.11 14,62 14,64 14.9,64.9 17.2,64.9 18,65.7 18,79.5 19.33,80.83 U7.30
AT_SCK
  Top 0.3: U7.17 28.03,87.24 28.43,87.64 32.43,87.64 35.63,84.44 35.63,80.14 36.31,79.46 39.85,79.46 39.81,79.42 | R28.1 39.81,73.64 39.81,79.42 | 39.81,79.42 J3.3
AT_TXD
  Top 0.3: U8.3.RXI 17.65,63.65 18.7,64.7 18.7,79.2 19.53,80.03 U7.31
AVCC
  Top 0.3: U7.18 27.23,87.34 27.73,87.84 C31.1 C30.1 R26.2
CANH  (via drill 0.5)  (1 unrouted)
  Top 0.3: R54.2 v36.9,16.5 37.83,17.43 U18.7
CANL  (via drill 0.5)  (1 unrouted)
  Top 0.3: R53.2 v35.9,17.5 36.8,17.5 37.17,17.88 U18.6
CURRENT-SENSE+
  Top 0.3: R45.2 83,5.5 83,7.75 arc90 U15.3
  pour Top (no thermals): 74,19.5 78,19.5 78,10 81,7 82.5,7 82.5,1 74,1
  pour Top (no thermals): 74,29 78,29 78,26.5 79,25.5 79,21.5 78,20.5 78,19.5 77,19.5 74.5,19 74.5,20 77,20 78.5,21.5 78.5,25 77.5,26 74,26
CURRENT-SENSE-
  Top 0.3: R45.1 85,5.5 85,7.75 arc-90 U15.4
  pour Top (no thermals): 85.5,7 88.5,7 91.5,10 91.5,17 99,17 99,6.5 96.5,6.5 94,4 94,1 85.5,1
DCBUS  (1 unrouted)
  Top 0.406: R33.1 40.24,47.26 U9.1
FAN  (1 unrouted)
  Top 0.3: U11.1 58.12,34.36 R39.1
GND  (via drill 0.5, 0.5 pad 0.9)  (1 unrouted)
  Top 0.3: U7.5 v25.63,79.04 | U7.3 v24.03,79.04 | U7.21 v24.83,84.94 | C33.2 v24.23,71.94 | C32.2 v26.23,71.94 | C27.1 v33.33,71.34 C28.1 | LED2.C 37.53,73.52 v37.53,74.64 | C36.2 v25.73,91.93 | C31.2 v27.73,91.93 | C30.2 v29.73,91.93 | C29.2 v16.63,89.54 | C35.2 v16.73,77.04 | C22.2 C23.2 54.37,64.37 v54.5,64.5 | U4.4 53.33,57.33 v53,57 | C9.2 C10.2 54.37,85.87 v54.5,86 54.91,86.41 U3.4 | U2.4 53.33,78.83 v53,78.5 | U6.2 54.77,68.23 C18.2 52.72,68.68 C19.2ASDF C25.2ASDF 49.15,69 v48,69 | U3.2 53.3,89.86 C12.2 52.72,90.18 C13.2ASDF C11.2ASDF 49.15,90.5 v48,90.5 | U10.3 59.93,21.43 v59.5,21 | U11.3 59.87,30.87 v59.5,30.5 | U9.3 42.21,43.71 v42,43.5 | U13.4 60.54,5.2 C39.2 58.05,4.55 C40.2ASDF C46.2ASDF 54.95,4.5 v53.5,4.5 | U13.2 58.73,7.63 v58.7,7.6 | U12.4 v58.7,12.6 | C44.2 C43.2 59,19 v58.5,19.5 | v22.5,52.5 U17.2 U17.5 C56.2 C55.2 v30.5,52.5 | U16.2 C53.2 C54.2 v21,57.5 22,56.5 C52.2 | R52.2 v30,56.5 | U18.9 37.83,20.32 U18.2 37.83,22.12 38,22.3 C58.2 C59.2 38,24.6 v38.4,25 | C57.2 v35,20.5
  pour Route2: 1,1 61,1 61,35.5 43.5,35.5 43.5,55 56,55 56,99 1,99
GNDA  (via drill 0.5)  (1 unrouted)
  other vias: 76.87,84.23 79.87,86.23 59.37,86.33 59.37,83.63 59.37,84.93 63.07,86.23 64.27,86.23 65.27,85.53 66.47,85.53 67.37,84.63 67.37,85.83 59.37,77.73 60.47,77.73 61.57,77.73 70.47,81.33 72.97,88.43 73.97,87.43 73.97,83.03 73.07,82.13 71.87,89.03 67.87,87.53 68.87,88.53 68.87,89.73 68.87,90.93 76.67,89.83 75.57,88.73 77.37,79.63 76.27,80.73 76.87,62.73 79.87,64.73 59.37,64.83 59.37,62.13 59.37,63.43 63.07,64.73 64.27,64.73 65.27,64.03 66.47,64.03 67.37,63.13 67.37,64.33 59.37,56.23 60.47,56.23 61.57,56.23 70.47,59.83 72.97,66.93 73.97,65.93 73.97,61.53 73.07,60.63 71.87,67.53 67.87,66.03 68.87,67.03 68.87,68.23 68.87,69.43 76.67,68.33 75.57,67.23 77.37,58.13 76.27,59.23 60.5,71 60.5,92.5
  pour Top: 89.87,77.23 89.87,93.23 58.87,93.23 58.87,77.23
  pour Route2: 89.87,77.23 89.87,93.23 58.87,93.23 58.87,77.23
  pour Bottom: 89.87,77.23 89.87,93.23 58.87,93.23 58.87,77.23
  pour Top: 89.87,55.73 89.87,71.73 58.87,71.73 58.87,55.73
  pour Route2: 89.87,55.73 89.87,71.73 58.87,71.73 58.87,55.73
  pour Bottom: 89.87,55.73 89.87,71.73 58.87,71.73 58.87,55.73
GNDB  (via drill 0.5)
  Top 0.3: D3.1 51.9,40 54,40 54.36,40.36 Q1.2 | v49,39.7 49,41 | v72,3.5 72,4.55 C45.2ASDF 70.55,4.75 C38.2 FL9.1 | C49.2 v79.5,14 | C49.2 C48.2 U14.2 | C47.2 80.5,13.5 C49.2 | R48.2 v87.5,14 | U15.2 U15.5 C51.2 C50.2 v88.5,9 | R42.1 v66.5,10.5 | C41.2 C42.2 v65.5,20 | 69.83,20.42 69.7,20.29 v69.7,19.2 | 69.77,29.99 69.7,29.92 v69.7,28.8
  Top 0.406: R35.1 69.83,20.42 D4.1 | R38.1 69.77,29.99 D5.1 | R32.1 49,41 49.11,40.89 D3.1
  pour Route2 (no thermals): 99,1 99,35 79,35 71,43 48,43 48,39 65,39 65,1
HEATER  (1 unrouted)
  Top 0.3: U10.1 58.32,24.79 R36.1
ISO-SCL  (via drill 0.5)
  Top 0.3: R41.1 69.5,14.9 v68.5,13.9 68.47,13.87 U12.6 | U14.5 84.5,14 84,13.5 v84,12
  Bottom 0.3: v84,12 70.4,12 v68.5,13.9
ISO-SDA  (via drill 0.5)
  Top 0.3: R40.1 68.1,15.1 v67.2,15.1 67.17,15.13 U12.7 | U14.6 86.45,14.95 v87,15.5
  Bottom 0.3: v87,15.5 86,16.5 77.5,16.5 76.1,15.1 v67.2,15.1
LEAKAGE-CURRENT+
  Top 0.3: R49.2 24.5,49 24.5,51.25 arc90 U17.3
  pour Top (no thermals): 1,44 1,39 19,39 24,44 24,48.5 22,48.5 17.5,44
LEAKAGE-CURRENT-
  Top 0.3: R49.1 26.5,49 26.5,51.25 arc-90 U17.4
  pour Top (no thermals): 1,34 1,29 20.5,29 29.5,38 29.5,48.5 27,48.5 27,43 18,34
N$1
  Top 0.2: D1.6 79.03,83.57 79.37,83.23 R5.1
  Top 0.3: R1.2 R3.1 FL1.2 R5.1
N$2
  Top 0.3: U1.19 71.52,79.68 70.77,78.93 67.37,78.93 66.67,79.63 66.67,81.43 65.57,82.53 64.47,82.53 63.87,81.93 R9.1 62.47,80.83 61.73,80.09 U2.6
N$3  (via drill 0.5)
  Top 0.3: U1.20 72.17,79.53 70.97,78.33 67.17,78.33 66.07,79.43 66.07,80.43 65.67,80.83 R8.1 v64.87,81.63 | U2.7 61.6,81.36 61.87,81.63 v62.87,81.63
  Bottom 0.3: v64.87,81.63 v62.87,81.63
N$4
  Top 0.3: U5.19 71.52,58.18 70.77,57.43 67.37,57.43 66.67,58.13 66.67,59.93 65.57,61.03 64.47,61.03 63.87,60.43 R14.1 62.47,59.33 61.73,58.59 U4.6
N$5  (via drill 0.5)
  Top 0.3: U3.7 61.53,89.86 v61.57,89.83 | v61.57,86.53 C8.2 | U3.5 60.97,87.33 61.07,87.43 C8.2 | FL4.2 62.37,87.43 C8.2
  Bottom 0.3: v61.57,89.83 v61.57,86.53
N$6
  Top 0.3: FL3.2 62.37,88.43 C8.1 61.17,88.43 61.01,88.59 U3.6
N$7
  Top 0.3: U3.8 61.77,91.14 R11.2 R10.1
N$8  (via drill 0.5)
  Top 0.3: U5.20 72.17,58.03 70.97,56.83 67.17,56.83 66.07,57.93 66.07,58.93 65.67,59.33 R13.1 v64.87,60.13 | U4.7 61.6,59.87 61.87,60.13 v62.87,60.13
  Bottom 0.3: v64.87,60.13 v62.87,60.13
N$9
  Top 0.3: R6.2 R7.1 69.37,81.53 69.57,81.73 U1.16
N$10
  Top 0.3: R3.2 77.37,82.23 C1.1 74.72,84.58 U1.2
N$11
  Top 0.2: D1.3 77.71,87.69 R4.1
  Top 0.3: FL2.2 R2.2 R4.1
N$12
  Top 0.3: R4.2 74.87,85.93 C1.2 74.72,85.88 U1.4
N$13
  Top 0.3: J1.2 81.75,81.25 81.27,81.73 FL1.1
N$14
  Top 0.3: J1.1 81.85,89.21 81.37,88.73 FL2.1
N$15
  Top 0.3: R15.2 R16.1 69.37,60.03 69.57,60.23 U5.16
N$16
  Top 0.2: D2.6 79.03,62.07 79.37,61.73 R19.1
  Top 0.3: R18.2 R20.1 FL6.2 R19.1
N$17
  Top 0.2: D2.3 77.71,66.19 R21.1
  Top 0.3: FL5.2 R17.2 R21.1
N$18
  Top 0.3: R20.2 77.37,60.73 C26.1 74.72,63.08 U5.2
N$19
  Top 0.3: R21.2 74.87,64.43 C26.2 74.72,64.38 U5.4
N$20
  Top 0.3: J2.2 81.75,59.75 81.27,60.23 FL6.1
N$21
  Top 0.3: J2.1 81.85,67.71 81.37,67.23 FL5.1
N$22
  Top 0.3: U6.8 61.77,69.64 R22.2 R23.1
N$23  (via drill 0.5)
  Top 0.3: U6.7 61.53,68.36 v61.57,68.33 | v61.57,65.03 C16.2 | U6.5 60.97,65.83 61.07,65.93 C16.2 | FL7.2 62.37,65.93 C16.2
  Bottom 0.3: v61.57,68.33 v61.57,65.03
N$24
  Top 0.3: FL8.2 62.37,66.93 C16.1 61.17,66.93 61.01,67.09 U6.6
N$25
  Top 0.3: U7.20 25.63,88.48 arc-90 C36.1
N$26  (1 unrouted)
  Top 0.3: 31.73,73.04 31.73,71.54 | 31.72,73.03 33.22,73.03
N$27
  Top 0.3: 29.43,74.43 29.73,74.43 30.73,73.43 31.03,73.43
N$28
  Top 0.3: U10.4 69.46,22.25 R35.2
  Top 0.406: R35.2 72.53,22.47 D4.3 73.86,23.8 Q2.1
N$29
  Top 0.3: D3.3 52.11,42.94 Q1.1 | R32.2 48.71,43.19 U9.4
  Top 0.406: D3.3 51.81,42.94 R32.2
N$30  (via drill 0.5)
  Top 0.3: K1.A2 58.26,48.24 D6.C 56.96,46.99 v55.46,46.99 54.89,46.99 R31.2
  pour Route2 (no thermals): 99,37 99,51 48,51 48,45 72,45 80,37
N$31
  Top 0.3: K1.A1 59.26,40.74 58.01,41.99 Q1.3 56.96,41.99 D6.A
N$32
  pour Top (no thermals): 88.68,22.02 91.68,22.02 91.68,19.52 90.68,18.52 80.18,18.52 80.18,24.52 86.18,24.52
N$33
  Top 0.3: U11.4 69.4,31.82 R38.2
  Top 0.406: R38.2 72.47,32.04 D5.3 73.8,33.37 Q3.1
N$34
  pour Top (no thermals): 88.62,31.59 91.62,31.59 91.62,29.09 90.62,28.09 80.12,28.09 80.12,34.09 86.12,34.09
N$35
  Top 0.3: U10.6 68.04,24.79 R34.1
N$36
  Top 0.3: R31.1 50.82,47.26 U9.6
N$37
  Top 0.3: R28.2 37.55,71.74 LED2.A
N$39
  Top 0.3: U11.6 68.12,34.36 R37.1
N$41
  Top 0.3: R43.1 R42.2 66.91,8.9 U13.8
N$42  (via drill 0.5)
  Top 0.3: U13.5 65.57,5.2 C37.2 | C37.2 FL9.2 | v67.1,7.6 65.5,7.6 U13.7 | C37.2 v67.1,4.3
  Bottom 0.3: v67.1,4.3 v67.1,7.6
N$43
  Top 0.3: U13.6 66.94,6.37 arc-90 C37.1 FL10.2
N$44
  Top 0.3: U14.3 82.7,12.7 82,12 C47.1 R46.2
N$45
  Top 0.3: U15.1 81.05,9.95 arc-90 R46.1
N$46
  Top 0.3: U14.4 86.45,13.05 R48.1 R47.1
N$47
  Top 0.3: U16.3 24.2,56.2 23.5,55.5 C52.1 R50.2
N$48
  Top 0.3: U17.1 22.55,53.45 arc-90 R50.1
N$49
  Top 0.3: U16.4 27.95,56.55 R52.1 R51.1
N$51
  pour Top (no thermals): 1,23.5 19.5,23.5 19.5,10 19.5,9.5 1,9.5
N$52
  Top 0.3: R55.1 35.08,18.58 U18.5
N$53
  Top 0.3: R54.1 R53.1 R55.2 C57.1
N$54  (via drill 0.5)
  other vias: 38,20
N$55  (via drill 0.5)
  other vias: 37,20
PD4  (via drill 0.5)
  Top 0.3: U7.2 23.23,76.63 21.6,75 v19.6,75 | R30.1 15.22,75 v16.8,75
  Bottom 0.3: v16.8,75 v19.6,75
PD4-CAP
  Top 0.3: R29.2 R30.2 C35.1 11.78,78.54 B3.3.B B3.4.B
PDIS  (4 unrouted)
  Top 0.3: U13.1 R44.1
SCL  (4 unrouted)
SDA  (4 unrouted)
V+  (via drill 0.5)
  Top 0.406: R34.2 v72.52,25.82 | R37.2 v72.59,35.38
  pour Route15 (no thermals): 48,51 99,51 99,22.5 65,22.5 65,39 48,39
VDD  (via drill 0.5, 0.5 pad 0.9)  (2 unrouted)
  Top 0.3: C33.1 C32.1 26.23,76.04 26.43,76.24 U7.6 | U7.4 24.83,76.64 24.23,76.04 C33.1 | R29.1 v16.73,73.04 | v16.62,87.54 R25.1 | C33.1 24.18,75.04 v22.93,75.04 | R26.1 v31.73,91.93 | U4.1 53.87,61.13 53.37,61.63 C22.1 C23.1 53.37,64.13 v53,64.5 | U2.1 53.87,82.64 53.37,83.13 C9.1 C10.1 53.37,85.63 v53,86 | R24.2 v55,73 | R12.2 v55,94.5 | U6.3 53.17,67.09 C18.1 52.72,66.78 C19.1ASD C25.1ASD 49.19,66.5 v48,66.5 | U3.3 53.3,88.59 arc-90 C12.1 52.72,88.28 C13.1ASD C11.1ASD 49.19,88 v48,88 | v53.5,6.5 54.95,6.5 arc-90 C46.1ASD C40.1ASD arc90 57.25,6.2 C39.1 58.87,6.37 U13.3 | R44.2 v58.5,10.8 | U12.1 60.54,16.96 C44.1 C43.1 60,19 v60.5,19.5 | U16.1 23.05,58.45 arc-90 C53.1 C54.1 21.5,58.5 arc-90 v21,59 | R51.2 v30.5,54 29.5,54 C55.1 C56.1 26.85,53.5 U17.6 | U18.3 37.17,22.12 37,22.3 C58.1 C59.1 v37,25
  Top 0.406: R36.2 v54.48,25.18 | R33.2 v39.96,50.99
  other vias: 54.41,34.62
  pour Route15: 1,1 61,1 61,35.5 43.5,35.5 43.5,55 56,55 56,99 1,99
VISO  (via drill 0.5)  (1 unrouted)
  Top 0.3: v78.67,87.63 78.37,87.33 D1.2 D1.5 R5.2 | R8.2 R9.2 v62.87,79.83 | R7.2 v70.47,79.83 | U1.8 C2.2 C3.2 v70.87,91.43 | FL3.1 63.57,88.43 C7.1 64.82,88.88 C6.1ASD v66.07,90.23 | U2.8 61.08,82.64 61.37,82.93 C4.1 C5.1 v62.47,85.23
  other vias: 64.07,92.23
  pour Route15: 89.87,77.23 89.87,93.23 58.87,93.23 58.87,77.23
VISO1  (via drill 0.5)  (1 unrouted)
  Top 0.3: v78.67,66.13 78.37,65.83 D2.2 D2.5 R19.2 | R13.2 R14.2 v62.87,58.33 | R16.2 v70.47,58.33 | U5.8 C15.2 C14.2 v70.87,69.93 | FL8.1 63.57,66.93 C17.1 64.82,67.38 C24.1ASD v66.07,68.73 | U4.8 61.08,61.13 61.37,61.43 C21.1 C20.1 v62.47,63.73
  other vias: 64.07,70.73
  pour Route15: 89.87,55.73 89.87,71.73 58.87,71.73 58.87,55.73
VISO2  (via drill 0.5)
  Top 0.3: FL10.1 C38.1 70.55,6.65 C45.1ASD 72,6.85 v72,8 | R43.2 v69.5,10.5 | U12.8 66.11,16.41 66.5,16.8 C41.1 C42.1 v67.5,19 | R40.2 R41.2 v69.5,17.5 | U14.1 81.55,14.95 arc-90 C48.1 C49.1 80,15.5 v79.5,15.5 | U15.6 85.35,10 C51.1 C50.1 v87.5,11 R47.2
  pour Route15: 65,21 99,21 99,1 65,1
XTAL1
  Top 0.3: C27.2 29.03,72.34 Y1.3 28.12,73.14 27.73,73.53 27.73,75.73 27.23,76.23 U7.7
XTAL2
  Top 0.3: Y1.1 30.93,75.24 30.93,75.54 30.53,75.94 28.53,75.94 28.03,76.44 U7.8 | 31.53,74.84 Y1.1 | C28.2 31.53,74.64 Y1.1

### Text on the board
tPlace: RESET | PD4 | DUT- | DC+(2) | FAN | DC-(1) | HEATER | DUT+ | DC+(1) | DC-(2)